# Altium project 海关全向本体电路板V3.PrjPcb
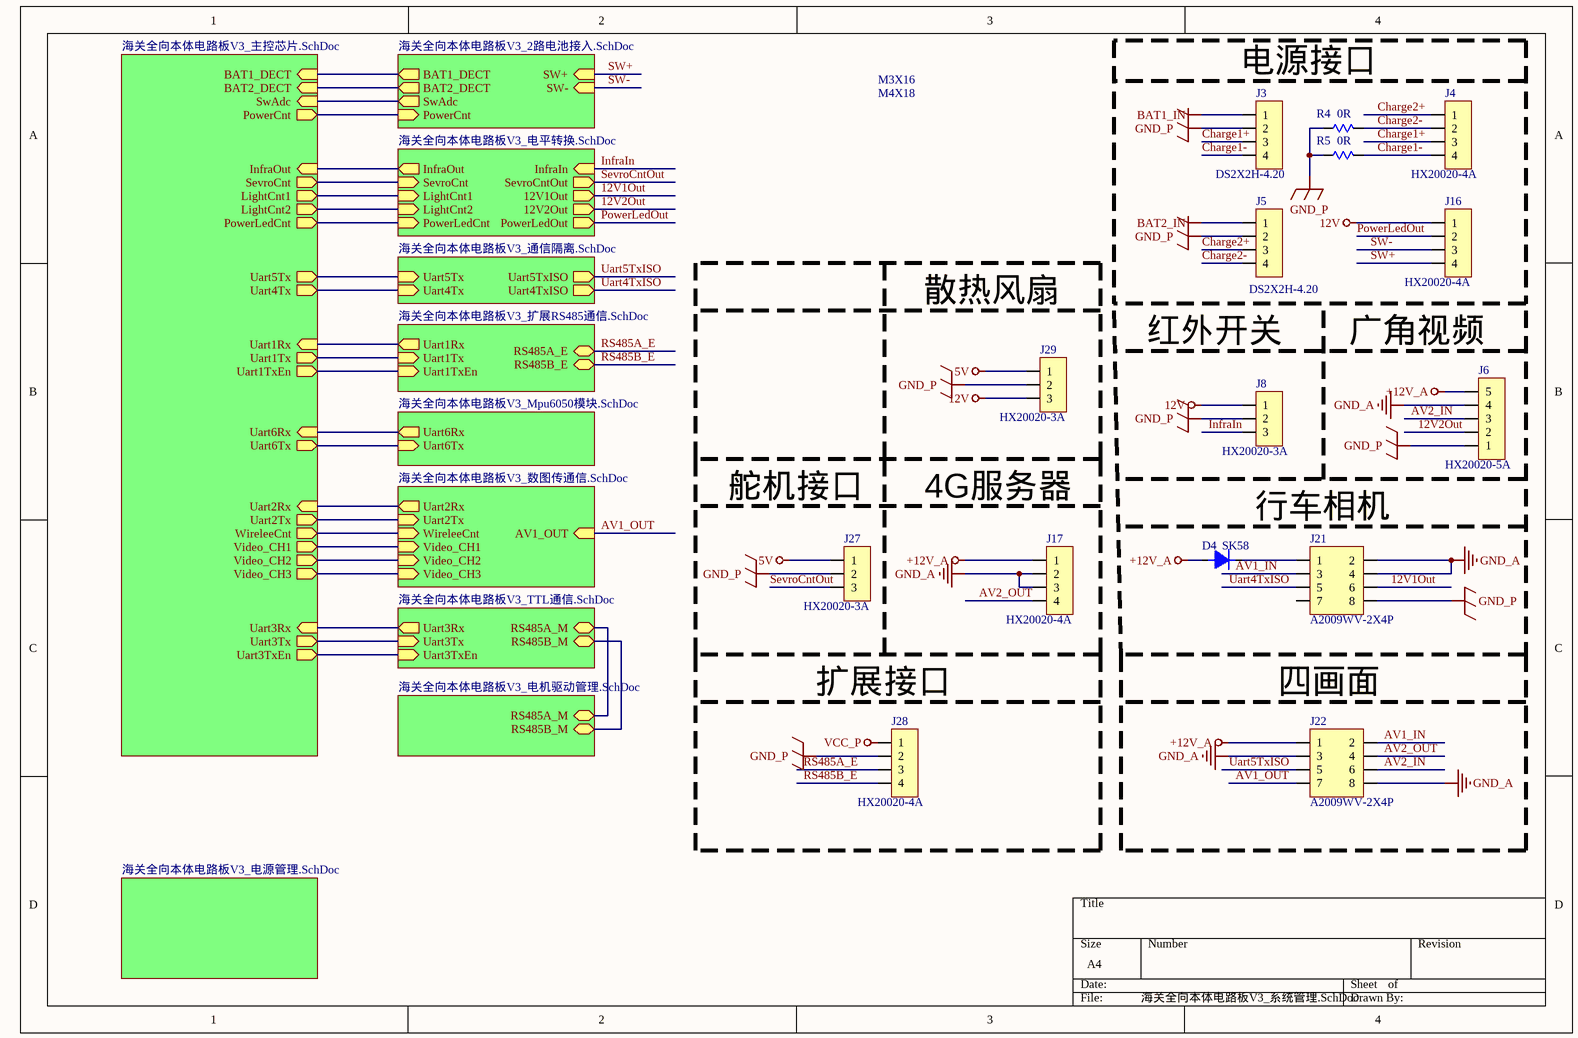
[diagram p0: 海关全向本体电路板V3_系统管理.SchDoc]
17 sheets, 222 parts. Net scope: hierarchical (ports join the sheet entries above them; power ports are global).
Board files: 4G视频服务器尺寸.PcbDoc, 海关全向本体电路板V3.PcbDoc
Sheets:
  海关全向本体电路板V3_系统管理.SchDoc
     = 海关全向本体电路板V3_电机驱动管理.SchDoc
     = 海关全向本体电路板V3_电源管理.SchDoc
     = 海关全向本体电路板V3_主控芯片.SchDoc
      STM32F407VG-A = STM32F407VG-A.SchDoc
      STM32F407VG-B = STM32F407VG-B.SchDoc
      STM32F407VG-C = STM32F407VG-C.SchDoc
      STM32F407VG-D = STM32F407VG-D.SchDoc
      STM32F407VG-E = STM32F407VG-E.SchDoc
      STM32F407VG-F = STM32F407VG-F.SchDoc
     = 海关全向本体电路板V3_电平转换.SchDoc
     = 海关全向本体电路板V3_TTL通信.SchDoc
     = 海关全向本体电路板V3_数图传通信.SchDoc
     = 海关全向本体电路板V3_扩展RS485通信.SchDoc
     = 海关全向本体电路板V3_2路电池接入.SchDoc
     = 海关全向本体电路板V3_通信隔离.SchDoc
     = 海关全向本体电路板V3_Mpu6050模块.SchDoc

## Sheet 海关全向本体电路板V3_系统管理.SchDoc
size A4

### Parts
D4  SK58  [SMB]
J3  DS2X2H-4.20  [5566-04A]
J4  HX20020-4A  [HX20020-4A]
J5  DS2X2H-4.20  [5566-04A]
J6  HX20020-5A  [HX20020-5A]
J8  HX20020-3A  [HX20020-3A]
J16  HX20020-4A  [HX20020-4A]
J17  HX20020-4A  [HX20020-4A]
J21  A2009WV-2X4P  [A2009WV-2X4P]
J22  A2009WV-2X4P  [A2009WV-2X4P]
J27  HX20020-3A  [HX20020-3A]
J28  HX20020-4A  [HX20020-4A]
J29  HX20020-3A  [HX20020-3A]
R4  0R  [R1206-S]
R5  0R  [R1206-S]

### Blocks framed on the sheet
电源接口: J3-J5 J16 R4 R5

### Sub-sheets
? = 海关全向本体电路板V3_电机驱动管理.SchDoc: RS485A_M, RS485B_M
? = 海关全向本体电路板V3_电源管理.SchDoc: no entries
? = 海关全向本体电路板V3_主控芯片.SchDoc: SevroCnt (out), LightCnt1 (out), PowerCnt (out), SwAdc (in), LightCnt2 (out), Uart2Rx (in), Uart2Tx (out), Uart1Tx (out), BAT1_DECT (in), BAT2_DECT (in), PowerLedCnt (out), Uart1Rx (in), Uart4Tx (out), Uart5Tx (out), Uart1TxEn (out), Uart6Tx (out), Uart6Rx (in), Video_CH1 (out), Video_CH2 (out), Video_CH3 (out), WireleeCnt (out), InfraOut (in), Uart3Rx (in), Uart3Tx (out), Uart3TxEn (out)
? = 海关全向本体电路板V3_电平转换.SchDoc: SevroCnt (in), LightCnt1 (in), SevroCntOut (out), 12V1Out (out), LightCnt2 (in), 12V2Out (out), PowerLedCnt (in), PowerLedOut (out), InfraIn (in), InfraOut (out)
? = 海关全向本体电路板V3_TTL通信.SchDoc: RS485A_M, RS485B_M, Uart3Rx (out), Uart3Tx (in), Uart3TxEn (in)
? = 海关全向本体电路板V3_数图传通信.SchDoc: Uart2Rx (out), Uart2Tx (in), Video_CH1 (in), Video_CH2 (in), Video_CH3 (in), WireleeCnt (in), AV1_OUT (in)
? = 海关全向本体电路板V3_扩展RS485通信.SchDoc: Uart1Rx (out), Uart1Tx (in), Uart1TxEn (in), RS485A_E (bidir), RS485B_E (bidir)
? = 海关全向本体电路板V3_2路电池接入.SchDoc: PowerCnt (in), SwAdc (out), SW+ (in), SW- (in), BAT1_DECT (out), BAT2_DECT (out)
? = 海关全向本体电路板V3_通信隔离.SchDoc: Uart5Tx (in), Uart4Tx (in), Uart5TxISO (out), Uart4TxISO (out)
? = 海关全向本体电路板V3_Mpu6050模块.SchDoc: Uart6Rx (out), Uart6Tx (in)

### Nets
5V: J27.1 J29.1
12V: J8.1 J16.1 J29.3
+12V_A: D4.1(A) J6.5 J17.1 J22.1
BAT1_IN: J3.1
BAT2_IN: J5.1
GND_A: J6.4 J17.2 J17.3 J21.2 J21.4 J22.3 J22.8
GND_P: J3.2 J5.2 J6.1 J8.2 J21.8 J27.2 J28.2 J29.2 R4.1 R5.1
VCC_P: J28.1
12V1Out: J21.6 ; sheet /12V1Out
12V2Out: J6.2 ; sheet /12V2Out
AV1_IN: J21.3 J22.2
AV1_OUT: J22.7 ; sheet /AV1_OUT
AV2_IN: J6.3 J22.6
AV2_OUT: J17.4 J22.4
Charge1+: J3.3 J4.3
Charge1-: J3.4 J4.4 R5.2
Charge2+: J4.1 J5.3
Charge2-: J4.2 J5.4 R4.2
InfraIn: J8.3 ; sheet /InfraIn
PowerLedOut: J16.2 ; sheet /PowerLedOut
RS485A_E: J28.3 ; sheet /RS485A_E
RS485A_M: sheet /RS485A_M, sheet /RS485A_M
RS485B_E: J28.4 ; sheet /RS485B_E
RS485B_M: sheet /RS485B_M, sheet /RS485B_M
SevroCntOut: J27.3 ; sheet /SevroCntOut
SW+: J16.4 ; sheet /SW+
SW-: J16.3 ; sheet /SW-
Uart4TxISO: J21.5 ; sheet /Uart4TxISO
Uart5TxISO: J22.5 ; sheet /Uart5TxISO
NetC21_2: sheet /SevroCnt, sheet /SevroCnt
NetC28_1: sheet /BAT1_DECT, sheet /BAT1_DECT
NetC30_1: sheet /BAT2_DECT, sheet /BAT2_DECT
NetC57_2: sheet /SwAdc, sheet /SwAdc
NetD4_2: D4.2(K) J21.1
NetJ2_4: sheet /Uart2Rx, sheet /Uart2Rx
NetJ2_6: sheet /Uart2Tx, sheet /Uart2Tx
NetR6_2: sheet /InfraOut, sheet /InfraOut
NetR20_1: sheet /PowerCnt, sheet /PowerCnt
NetR39_1: sheet /Uart3TxEn, sheet /Uart3TxEn
NetR44_1: sheet /Uart1TxEn, sheet /Uart1TxEn
NetR53_2: sheet /WireleeCnt, sheet /WireleeCnt
NetR70_2: sheet /PowerLedCnt, sheet /PowerLedCnt
NetR71_2: sheet /LightCnt1, sheet /LightCnt1
NetR72_2: sheet /LightCnt2, sheet /LightCnt2
NetU2_3: sheet /Uart5Tx, sheet /Uart5Tx
NetU2_4: sheet /Uart4Tx, sheet /Uart4Tx
NetU3_15: sheet /Video_CH1, sheet /Video_CH1
NetU3_16: sheet /Video_CH2, sheet /Video_CH2
NetU3_17: sheet /Video_CH3, sheet /Video_CH3
NetU3_55: sheet /Uart3Tx, sheet /Uart3Tx
NetU3_56: sheet /Uart3Rx, sheet /Uart3Rx
NetU3_63: sheet /Uart6Tx, sheet /Uart6Tx
NetU3_64: sheet /Uart6Rx, sheet /Uart6Rx
NetU3_68: sheet /Uart1Tx, sheet /Uart1Tx
NetU3_69: sheet /Uart1Rx, sheet /Uart1Rx

Not connected (* = marked no-connect by the designer): J21 7

### Notes on the sheet
- M3X16
- M4X18
- 散热风扇
- 红外开关
- 广角视频
- 舵机接口
- 4G服务器
- (near J21) 行车相机
- (near J28) 扩展接口
- 四画面

### Library data of the parts
D4 = DIODE1: Diode
J3-J5 J16 J17 J28 = HEADER1X4
J6 = HEADER1X5
J8 J27 J29 = HEADER1X3
J21 J22 = HEADER2X4
R4 R5 = RES: Resistor; Published: 8-Jun-2000; LatestRevisionDate: 17-Jul-2002; LatestRevisionNote: Re-released for DXP Platform.; PackageReference: AXIAL-0.3; Publisher: Altium Limited; Value: 0R

## Sheet 海关全向本体电路板V3_电机驱动管理.SchDoc
size A3
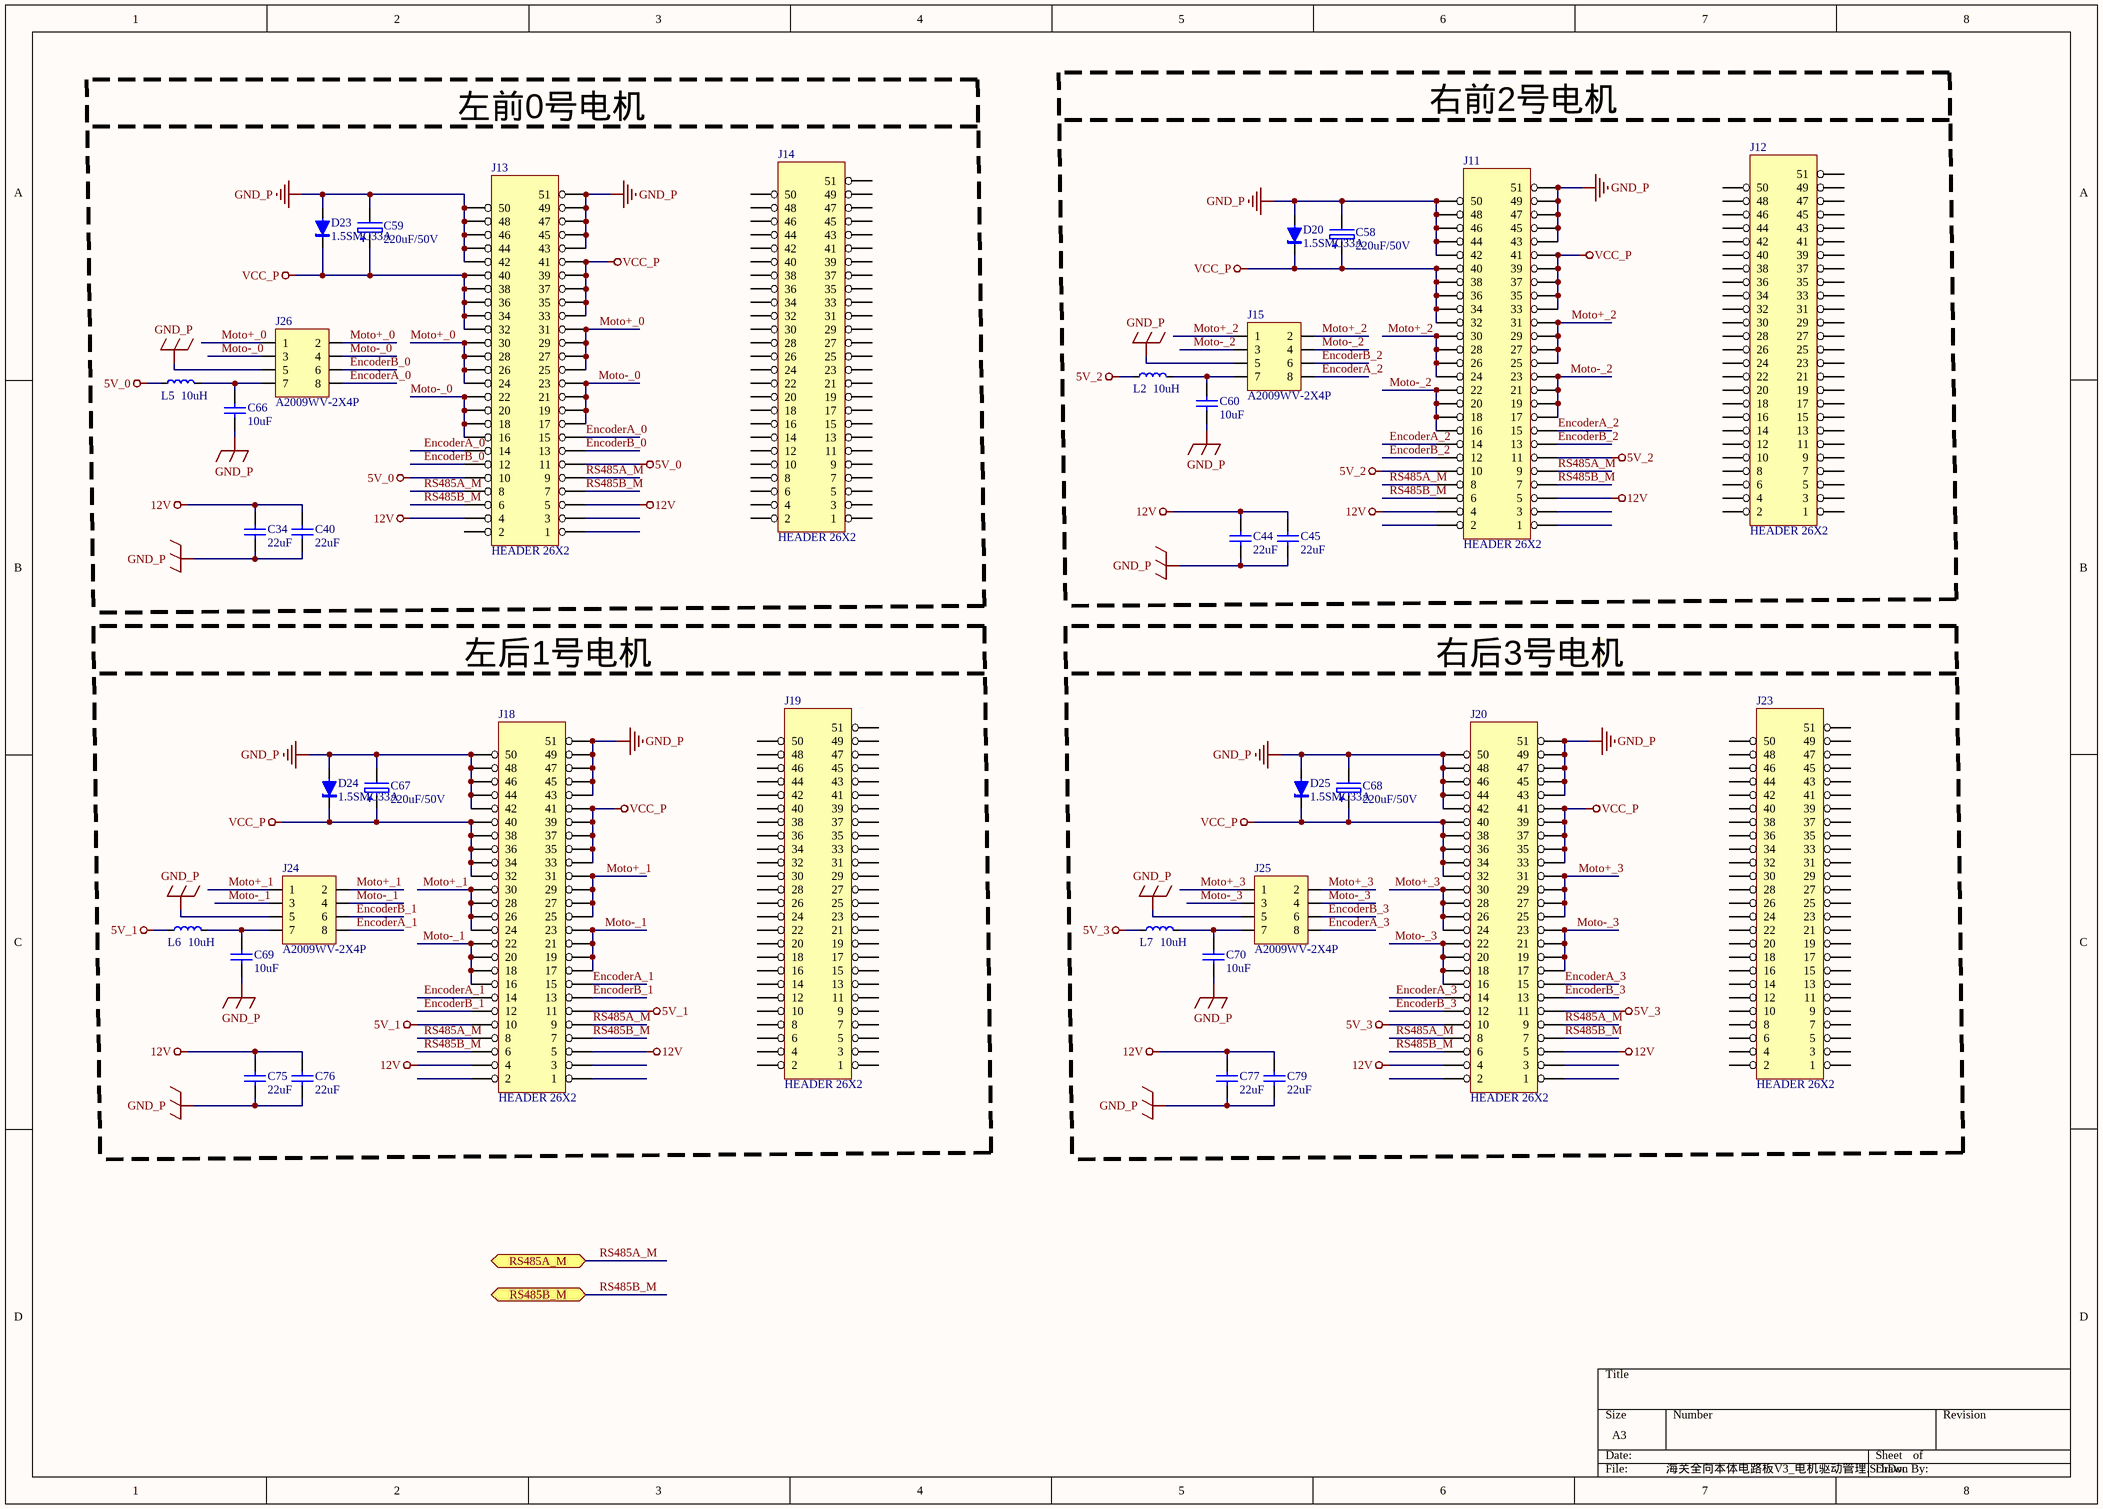
[diagram p1: 海关全向本体电路板V3_电机驱动管理.SchDoc]

### Parts
C34  22uF  [C1206-S]
C40  22uF  [C1206-S]
C44  22uF  [C1206-S]
C45  22uF  [C1206-S]
C58  220uF/50V  [CAPPR-10X10-SM]
C59  220uF/50V  [CAPPR-10X10-SM]
C60  10uF  [C0603-S]
C66  10uF  [C0603-S]
C67  220uF/50V  [CAPPR-10X10-SM]
C68  220uF/50V  [CAPPR-10X10-SM]
C69  10uF  [C0603-S]
C70  10uF  [C0603-S]
C75  22uF  [C1206-S]
C76  22uF  [C1206-S]
C77  22uF  [C1206-S]
C79  22uF  [C1206-S]
D20  1.5SMC33A  [SMC-S]
D23  1.5SMC33A  [SMC-S]
D24  1.5SMC33A  [SMC-S]
D25  1.5SMC33A  [SMC-S]
J11  HEADER 26X2  [DF9-51P-1V]
J12  HEADER 26X2  [DF9-51P-1V]
J13  HEADER 26X2  [DF9-51P-1V]
J14  HEADER 26X2  [DF9-51P-1V]
J15  A2009WV-2X4P  [A2009WV-2X4P]
J18  HEADER 26X2  [DF9-51P-1V]
J19  HEADER 26X2  [DF9-51P-1V]
J20  HEADER 26X2  [DF9-51P-1V]
J23  HEADER 26X2  [DF9-51P-1V]
J24  A2009WV-2X4P  [A2009WV-2X4P]
J25  A2009WV-2X4P  [A2009WV-2X4P]
J26  A2009WV-2X4P  [A2009WV-2X4P]
L2  10uH  [L0805-C]
L5  10uH  [L0805-C]
L6  10uH  [L0805-C]
L7  10uH  [L0805-C]

### Blocks framed on the sheet
左前0号电机: C34 C40 C59 C66 D23 J13 J14 J26 L5
右前2号电机: C44 C45 C58 C60 D20 J11 J12 J15 L2
左后1号电机: C67 C69 C75 C76 D24 J18 J19 J24 L6
右后3号电机: C68 C70 C77 C79 D25 J20 J23 J25 L7

### Ports
RS485A_M (bidir), RS485B_M (bidir)

### Nets
5V_0: J13.10 J13.11 L5.1
5V_1: J18.10 J18.11 L6.1
5V_2: J11.10 J11.11 L2.1
5V_3: J20.10 J20.11 L7.1
12V: C34.1 C40.1 C44.1 C45.1 C75.1 C76.1 C77.1 C79.1 J11.4 J11.5 J13.4 J13.5 J18.4 J18.5 J20.4 J20.5
GND_P: C34.2 C40.2 C44.2 C45.2 C58.2 C59.2 C60.2 C66.2 C67.2 C68.2 C69.2 C70.2 C75.2 C76.2 C77.2 C79.2 D20.1(A) D23.1(A) D24.1(A) D25.1(A) J11.42 J11.43 J11.44 J11.45 J11.46 J11.47 J11.48 J11.49 J11.50 J11.51 J13.42 J13.43 J13.44 J13.45 J13.46 J13.47 J13.48 J13.49 J13.50 J13.51 J15.5 J18.42 J18.43 J18.44 J18.45 J18.46 J18.47 J18.48 J18.49 J18.50 J18.51 J20.42 J20.43 J20.44 J20.45 J20.46 J20.47 J20.48 J20.49 J20.50 J20.51 J24.5 J25.5 J26.5
VCC_P: C58.1 C59.1 C67.1 C68.1 D20.2(K) D23.2(K) D24.2(K) D25.2(K) J11.32 J11.33 J11.34 J11.35 J11.36 J11.37 J11.38 J11.39 J11.40 J11.41 J13.32 J13.33 J13.34 J13.35 J13.36 J13.37 J13.38 J13.39 J13.40 J13.41 J18.32 J18.33 J18.34 J18.35 J18.36 J18.37 J18.38 J18.39 J18.40 J18.41 J20.32 J20.33 J20.34 J20.35 J20.36 J20.37 J20.38 J20.39 J20.40 J20.41
EncoderA_0: J13.14 J13.15 J26.8
EncoderA_1: J18.14 J18.15 J24.8
EncoderA_2: J11.14 J11.15 J15.8
EncoderA_3: J20.14 J20.15 J25.8
EncoderB_0: J13.12 J13.13 J26.6
EncoderB_1: J18.12 J18.13 J24.6
EncoderB_2: J11.12 J11.13 J15.6
EncoderB_3: J20.12 J20.13 J25.6
Moto+_0: J13.24 J13.25 J13.26 J13.27 J13.28 J13.29 J13.30 J13.31 J26.1 J26.2
Moto+_1: J18.24 J18.25 J18.26 J18.27 J18.28 J18.29 J18.30 J18.31 J24.1 J24.2
Moto+_2: J11.24 J11.25 J11.26 J11.27 J11.28 J11.29 J11.30 J11.31 J15.1 J15.2
Moto+_3: J20.24 J20.25 J20.26 J20.27 J20.28 J20.29 J20.30 J20.31 J25.1 J25.2
Moto-_0: J13.16 J13.17 J13.18 J13.19 J13.20 J13.21 J13.22 J13.23 J26.3 J26.4
Moto-_1: J18.16 J18.17 J18.18 J18.19 J18.20 J18.21 J18.22 J18.23 J24.3 J24.4
Moto-_2: J11.16 J11.17 J11.18 J11.19 J11.20 J11.21 J11.22 J11.23 J15.3 J15.4
Moto-_3: J20.16 J20.17 J20.18 J20.19 J20.20 J20.21 J20.22 J20.23 J25.3 J25.4
RS485A_M: J11.8 J11.9 J13.8 J13.9 J18.8 J18.9 J20.8 J20.9 ; port RS485A_M
RS485B_M: J11.6 J11.7 J13.6 J13.7 J18.6 J18.7 J20.6 J20.7 ; port RS485B_M
NetC60_1: C60.1 J15.7 L2.2
NetC66_1: C66.1 J26.7 L5.2
NetC69_1: C69.1 J24.7 L6.2
NetC70_1: C70.1 J25.7 L7.2

Not connected (* = marked no-connect by the designer): J11 1 2 3; J12 1 2 3 4 5 6 7 8 9 10 11 12 13 14 15 16 17 18 19 20 21 22 23 24 25 26 27 28 29 30 31 32 33 34 35 36 37 38 39 40 41 42 43 44 45 46 47 48 49 50 51; J13 1 2 3; J14 1 2 3 4 5 6 7 8 9 10 11 12 13 14 15 16 17 18 19 20 21 22 23 24 25 26 27 28 29 30 31 32 33 34 35 36 37 38 39 40 41 42 43 44 45 46 47 48 49 50 51; J18 1 2 3; J19 1 2 3 4 5 6 7 8 9 10 11 12 13 14 15 16 17 18 19 20 21 22 23 24 25 26 27 28 29 30 31 32 33 34 35 36 37 38 39 40 41 42 43 44 45 46 47 48 49 50 51; J20 1 2 3; J23 1 2 3 4 5 6 7 8 9 10 11 12 13 14 15 16 17 18 19 20 21 22 23 24 25 26 27 28 29 30 31 32 33 34 35 36 37 38 39 40 41 42 43 44 45 46 47 48 49 50 51

### Library data of the parts
C34 C40 C44 C45 C60 C66 C69 C70 C75-C77 C79 = CAP: Published: 8-Jun-2000; LatestRevisionDate: 17-Jul-2002; LatestRevisionNote: Re-released for DXP Platform.; PackageReference: RAD-0.3; Publisher: Altium Limited
  C34 C40 C44 C45 C75-C77 C79: Value: 22uF
  C60 C66 C69 C70: Value: 10uF
C58 C59 C67 C68 = ELECTRO: Electrolytic Capacitor
D20 D23-D25 = DIODE-ZENER: Small Signal Zener Diodes
J11-J14 J18-J20 J23 = HEADER 35X2_1
J15 J24-J26 = HEADER2X4
L2 L5-L7 = INDUCTOR: Code_IEC: 1005; Published: 8-Jun-2000; LatestRevisionDate: 17-Jul-2002; LatestRevisionNote: Re-released for DXP Platform.; PackageReference: 0402-A; Publisher: Altium Limited; Code_JEITA: 0402; Value: 10uH

## Sheet 海关全向本体电路板V3_电源管理.SchDoc
size A4
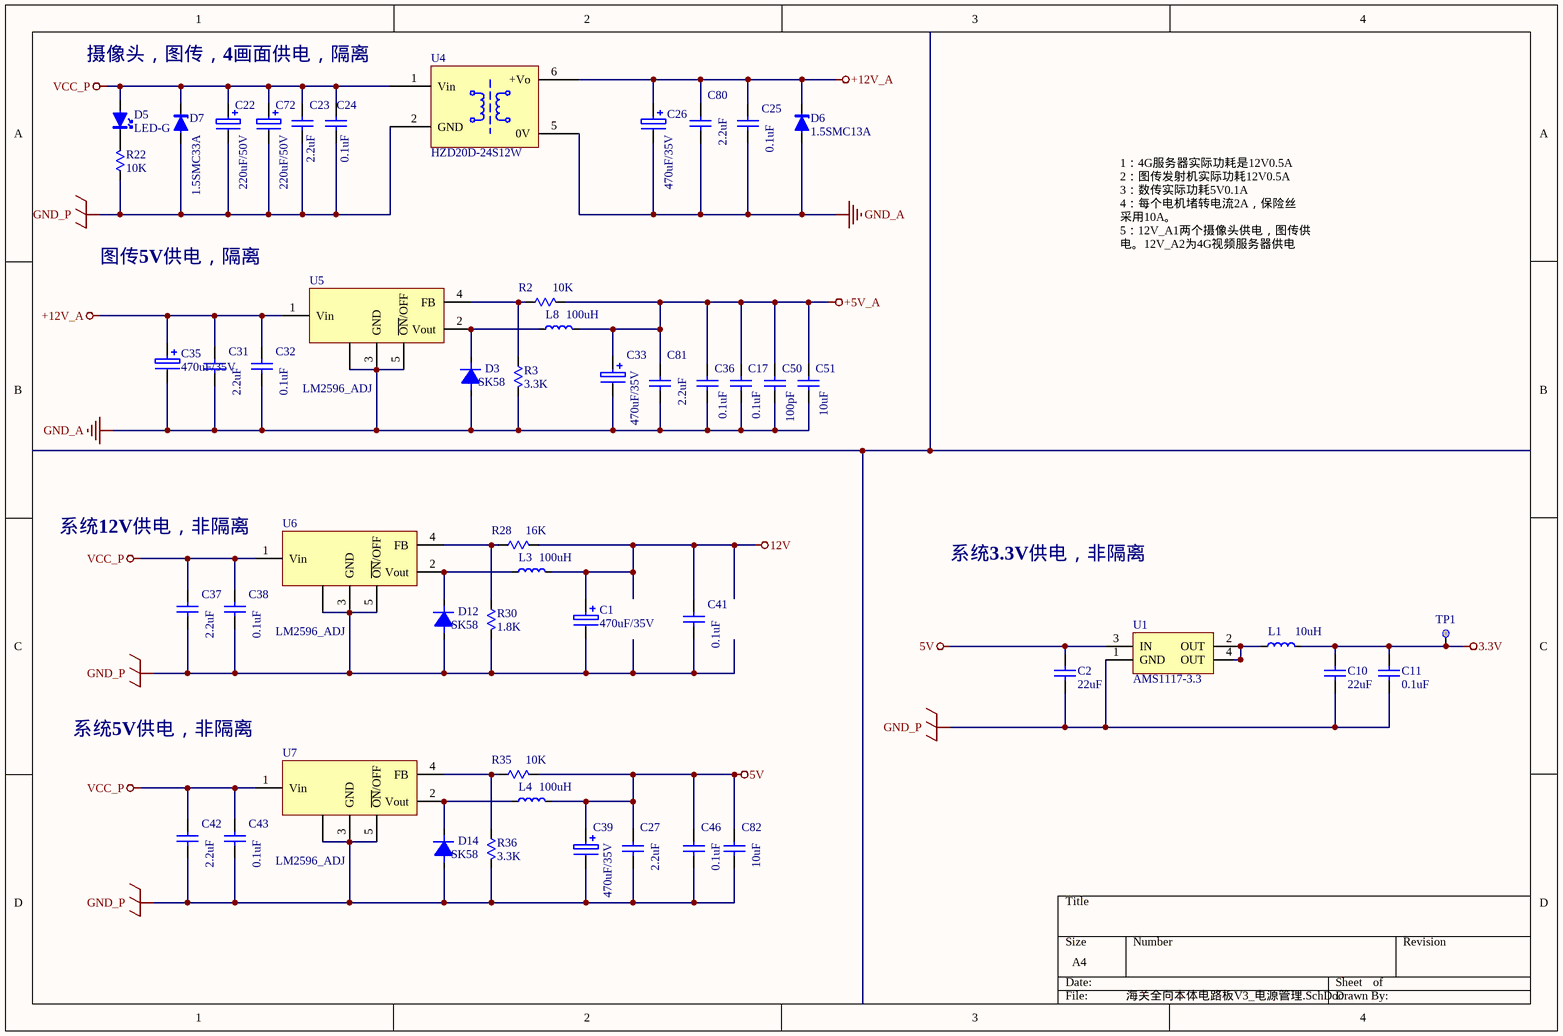
[diagram p2: 海关全向本体电路板V3_电源管理.SchDoc]

### Parts
C1  470uF/35V  [CAPPR-10X10-SM]
C2  22uF  [C1206-S]
C10  22uF  [C1206-S]
C11  0.1uF  [C0603-S]
C17  0.1uF  [C0603-S]
C22  220uF/50V  [CAPPR-10X10-SM]
C23  2.2uF  [C1210-S]
C24  0.1uF  [C0603-S]
C25  0.1uF  [C0603-S]
C26  470uF/35V  [CAPPR-10X10-SM]
C27  2.2uF  [C1210-S]
C31  2.2uF  [C1210-S]
C32  0.1uF  [C0603-S]
C33  470uF/35V  [CAPPR-10X10-SM]
C35  470uF/35V  [CAPPR-10X10-SM]
C36  0.1uF  [C0603-S]
C37  2.2uF  [C1210-S]
C38  0.1uF  [C0603-S]
C39  470uF/35V  [CAPPR-10X10-SM]
C41  0.1uF  [C0603-S]
C42  2.2uF  [C1210-S]
C43  0.1uF  [C0603-S]
C46  0.1uF  [C0603-S]
C50  100pF  [C0603-S]
C51  10uF  [C0603-S]
C72  220uF/50V  [CAPPR-10X10-SM]
C80  2.2uF  [C1210-S]
C81  2.2uF  [C1210-S]
C82  10uF  [C0603-S]
D3  SK58  [SMB-S]
D5  LED-G  [LED0805-S]
D6  1.5SMC13A  [SMC-S]
D7  1.5SMC33A  [SMC-S]
D12  SK58  [SMB-S]
D14  SK58  [SMB-S]
L1  10uH  [L0805-C]
L3  100uH  [L5050-P]
L4  100uH  [L5050-P]
L8  100uH  [L5050-P]
R2  10K  [R0805-S]
R3  3.3K  [R0805-S]
R22  10K  [R0805-S]
R28  16K  [R0805-S]
R30  1.8K  [R0805-S]
R35  10K  [R0805-S]
R36  3.3K  [R0805-S]
TP1  TestPoint  [MARK-S]  (value not drawn)
U1  AMS1117-3.3  [SOT-223]
U4  HZD20D-24S12W  [HZD20D-24S12W]
U5  LM2596_ADJ  [TO263]
U6  LM2596_ADJ  [TO263]
U7  LM2596_ADJ  [TO263]

### Nets
3.3V: C10.1 C11.2 L1.1 TP1.1
5V: C2.1 C27.2 C39.1 C46.2 C82.2 L4.1 R35.1 U1.3(IN)
12V: C1.1 C41.2 L3.1 R28.1
+5V_A: C17.2 C33.1 C36.2 C50.2 C51.2 C81.2 L8.1 R2.1
+12V_A: C25.2 C26.1 C31.2 C32.2 C35.1 C80.2 D6.2(K) U4.6(+Vo) U5.1(Vin)
GND_A: C17.1 C25.1 C26.2 C31.1 C32.1 C33.2 C35.2 C36.1 C50.1 C51.1 C80.1 C81.1 D3.1(A) D6.1(A) R3.1 U4.5(0V) U5.0(GND) U5.3(GND) U5.5(~{ON}/OFF)
GND_P: C1.2 C2.2 C10.2 C11.1 C22.2 C23.1 C24.1 C27.1 C37.1 C38.1 C39.2 C41.1 C42.1 C43.1 C46.1 C72.2 C82.1 D7.1(A) D12.1(A) D14.1(A) R22.2 R30.1 R36.1 U1.1(GND) U4.2(GND) U6.0(GND) U6.3(GND) U6.5(~{ON}/OFF) U7.0(GND) U7.3(GND) U7.5(~{ON}/OFF)
VCC_P: C22.1 C23.2 C24.2 C37.2 C38.2 C42.2 C43.2 C72.1 D5.1(A) D7.2(K) U4.1(Vin) U6.1(Vin) U7.1(Vin)
NetD3_2: D3.2(K) L8.2 U5.2(Vout)
NetD5_2: D5.2(K) R22.1
NetD12_2: D12.2(K) L3.2 U6.2(Vout)
NetD14_2: D14.2(K) L4.2 U7.2(Vout)
NetL1_2: L1.2 U1.2(OUT) U1.4(OUT)
NetR2_2: R2.2 R3.2 U5.4(FB)
NetR28_2: R28.2 R30.2 U6.4(FB)
NetR35_2: R35.2 R36.2 U7.4(FB)

### Notes on the sheet
- 摄像头，图传，4画面供电，隔离
- 图传5V供电，隔离
- 1：4G服务器实际功耗是12V0.5A
  2：图传发射机实际功耗12V0.5A
  3：数传实际功耗5V0.1A
  4：每个电机堵转电流2A，保险丝        采用10A。
  5：12V_A1两个摄像头供电，图传供电。12V_A2为4G视频服务器供电
- 系统12V供电，非隔离
- 系统3.3V供电，非隔离
- 系统5V供电，非隔离

### Library data of the parts
C1 C22 C26 C33 C35 C39 C72 = ELECTRO: Electrolytic Capacitor
C2 C10 C11 C17 C23-C25 C27 C31 C32 C36-C38 C41-C43 C46 C50 C51 C80-C82 = CAP: Published: 8-Jun-2000; LatestRevisionDate: 17-Jul-2002; LatestRevisionNote: Re-released for DXP Platform.; PackageReference: RAD-0.3; Publisher: Altium Limited
  C2 C10: Value: 22uF
  C11 C17 C24 C25 C32 C36 C38 C41 C43 C46: Value: 0.1uF
  C23 C27 C31 C37 C42 C80 C81: Value: 2.2uF
  C50: Value: 100pF
  C51 C82: Value: 10uF
D3 D12 D14 = DIODE1: Diode
D5 = LED
D6 D7 = DIODE-ZENER: Small Signal Zener Diodes
L1 L3 L4 L8 = INDUCTOR: Code_IEC: 1005; Published: 8-Jun-2000; LatestRevisionDate: 17-Jul-2002; LatestRevisionNote: Re-released for DXP Platform.; PackageReference: 0402-A; Publisher: Altium Limited; Code_JEITA: 0402
  L1: Value: 10uH
  L3 L4 L8: Value: 100uH
R2 R3 R28 R30 R35 R36 = RES: Resistor; Published: 8-Jun-2000; LatestRevisionDate: 17-Jul-2002; LatestRevisionNote: Re-released for DXP Platform.; PackageReference: AXIAL-0.3; Publisher: Altium Limited
  R2 R35: Value: 10K
  R3 R36: Value: 3.3K
  R28: Value: 16K
  R30: Value: 1.8K
R22 = Res: Resistor; Published: 8-Jun-2000; LatestRevisionDate: 04-Mar-2005; LatestRevisionNote: PCB Footprint replaced.; PackageReference: J1-0603; Publisher: Altium Limited; Value: 10K
U1 = REG1117-3.3: 800mA and 1A Low Dropout Positive Regulator 2.85V, 3.3V, 5V, and Adjustable; Package Information: Latest Revision: revC; Published: 8-Jun-2000; Revision: 17-Jul-2002: Re-released for DXP Platform.; Datasheet: Latest Revision: Sep-1997; Package Reference: ZZ311; Publisher: Altium Limited
U5-U7 = LM2575

## Sheet 海关全向本体电路板V3_主控芯片.SchDoc
size A4
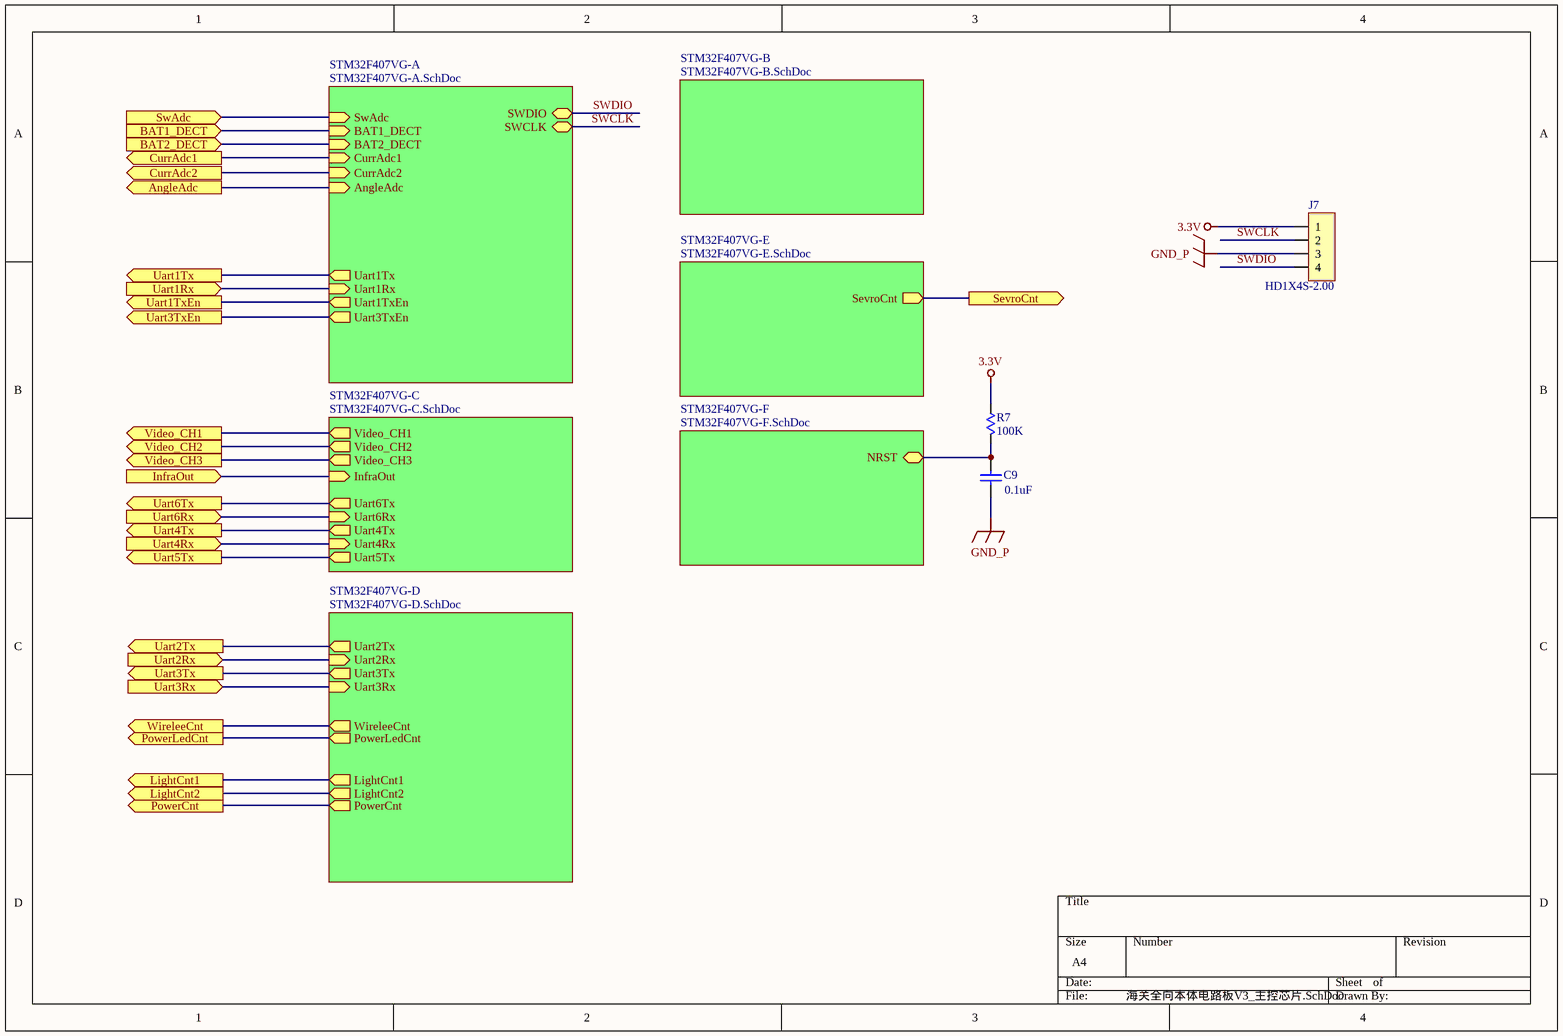
[diagram p3: 海关全向本体电路板V3_主控芯片.SchDoc]

### Parts
C9  0.1uF  [C0603-S]
J7  HD1X4S-2.00  [HD1X4S-2.00]
R7  100K  [R0603-S]

### Sub-sheets
STM32F407VG-A = STM32F407VG-A.SchDoc: SWDIO (bidir), SWCLK (bidir), Uart1Tx (out), Uart1Rx (in), AngleAdc (in), CurrAdc1 (in), BAT2_DECT (in), BAT1_DECT (in), SwAdc (in), CurrAdc2 (in), Uart1TxEn (out), Uart3TxEn (out)
STM32F407VG-B = STM32F407VG-B.SchDoc: no entries
STM32F407VG-C = STM32F407VG-C.SchDoc: Uart4Tx (out), Uart4Rx (in), Uart5Tx (out), Video_CH3 (out), Video_CH2 (out), Video_CH1 (out), Uart6Tx (out), Uart6Rx (in), InfraOut (in)
STM32F407VG-D = STM32F407VG-D.SchDoc: Uart2Tx (out), Uart2Rx (in), Uart3Tx (out), PowerLedCnt (out), LightCnt1 (out), Uart3Rx (in), PowerCnt (out), LightCnt2 (out), WireleeCnt (out)
STM32F407VG-E = STM32F407VG-E.SchDoc: SevroCnt (out)
STM32F407VG-F = STM32F407VG-F.SchDoc: NRST (bidir)

### Ports
AngleAdc (out), BAT1_DECT (in), BAT2_DECT (in), CurrAdc1 (out), CurrAdc2 (out), InfraOut (in), LightCnt1 (out), LightCnt2 (out), PowerCnt (out), PowerLedCnt (out), SevroCnt (out), SwAdc (in), Uart1Rx (in), Uart1Tx (out), Uart1TxEn (out), Uart2Rx (in), Uart2Tx (out), Uart3Rx (in), Uart3Tx (out), Uart3TxEn (out), Uart4Rx (in), Uart4Tx (out), Uart5Tx (out), Uart6Rx (in), Uart6Tx (out), Video_CH1 (out), Video_CH2 (out), Video_CH3 (out), WireleeCnt (out)

### Nets
3.3V: J7.1 R7.2
GND_P: C9.2 J7.3
NRST: C9.1 R7.1 ; sheet STM32F407VG-F/NRST
SWCLK: J7.2 ; sheet STM32F407VG-A/SWCLK
SWDIO: J7.4 ; sheet STM32F407VG-A/SWDIO
Uart4Rx: port Uart4Rx, sheet STM32F407VG-C/Uart4Rx
NetC21_2: port SevroCnt, sheet STM32F407VG-E/SevroCnt
NetC28_1: port BAT1_DECT, sheet STM32F407VG-A/BAT1_DECT
NetC30_1: port BAT2_DECT, sheet STM32F407VG-A/BAT2_DECT
NetC57_2: port SwAdc, sheet STM32F407VG-A/SwAdc
NetJ2_4: port Uart2Rx, sheet STM32F407VG-D/Uart2Rx
NetJ2_6: port Uart2Tx, sheet STM32F407VG-D/Uart2Tx
NetR6_2: port InfraOut, sheet STM32F407VG-C/InfraOut
NetR20_1: port PowerCnt, sheet STM32F407VG-D/PowerCnt
NetR39_1: port Uart3TxEn, sheet STM32F407VG-A/Uart3TxEn
NetR44_1: port Uart1TxEn, sheet STM32F407VG-A/Uart1TxEn
NetR53_2: port WireleeCnt, sheet STM32F407VG-D/WireleeCnt
NetR70_2: port PowerLedCnt, sheet STM32F407VG-D/PowerLedCnt
NetR71_2: port LightCnt1, sheet STM32F407VG-D/LightCnt1
NetR72_2: port LightCnt2, sheet STM32F407VG-D/LightCnt2
NetU2_3: port Uart5Tx, sheet STM32F407VG-C/Uart5Tx
NetU2_4: port Uart4Tx, sheet STM32F407VG-C/Uart4Tx
NetU3_15: port Video_CH1, sheet STM32F407VG-C/Video_CH1
NetU3_16: port Video_CH2, sheet STM32F407VG-C/Video_CH2
NetU3_17: port Video_CH3, sheet STM32F407VG-C/Video_CH3
NetU3_25: port AngleAdc, sheet STM32F407VG-A/AngleAdc
NetU3_30: port CurrAdc1, sheet STM32F407VG-A/CurrAdc1
NetU3_31: port CurrAdc2, sheet STM32F407VG-A/CurrAdc2
NetU3_55: port Uart3Tx, sheet STM32F407VG-D/Uart3Tx
NetU3_56: port Uart3Rx, sheet STM32F407VG-D/Uart3Rx
NetU3_63: port Uart6Tx, sheet STM32F407VG-C/Uart6Tx
NetU3_64: port Uart6Rx, sheet STM32F407VG-C/Uart6Rx
NetU3_68: port Uart1Tx, sheet STM32F407VG-A/Uart1Tx
NetU3_69: port Uart1Rx, sheet STM32F407VG-A/Uart1Rx

### Library data of the parts
C9 = Cap: Capacitor; Published: 8-Jun-2000; Revision: July-2002: Re-released for DXP Platform.; Publisher: Altium Limited; Value: 0.1uF
J7 = HEADER1X4
R7 = Res: Resistor; Published: 8-Jun-2000; LatestRevisionDate: 04-Mar-2005; LatestRevisionNote: PCB Footprint replaced.; PackageReference: J1-0603; Publisher: Altium Limited; Value: 100K

## Sheet STM32F407VG-A.SchDoc
size A4
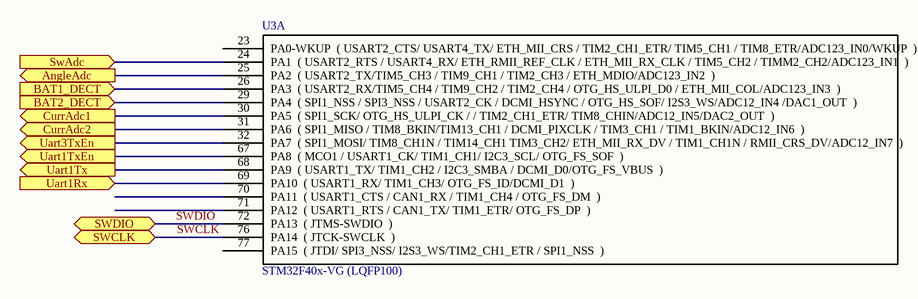
[diagram p4: STM32F407VG-A.SchDoc]

### Parts
U3  STM32F40x-VG (LQFP100)  [LQFP100_N]  (part A of 6)

### Ports
AngleAdc (out), BAT1_DECT (in), BAT2_DECT (in), CurrAdc1 (out), CurrAdc2 (out), SwAdc (in), SWCLK (bidir), SWDIO (bidir), Uart1Rx (in), Uart1Tx (out), Uart1TxEn (out), Uart3TxEn (out)

### Nets
SWCLK: U3.76(PA14__(_JTCK-SWCLK__)) ; port SWCLK
SWDIO: U3.72(PA13__(_JTMS-SWDIO__)) ; port SWDIO
NetC28_1: U3.26(PA3__(_USART2_RX/TIM5_CH4_/_TIM9_CH2_/_TIM2_CH4_/_OTG_HS_ULPI_D0_/_ETH_MII_COL/ADC123_IN3__)) ; port BAT1_DECT
NetC30_1: U3.29(PA4__(_SPI1_NSS_/_SPI3_NSS_/_USART2_CK_/_DCMI_HSYNC_/_OTG_HS_SOF/_I2S3_WS/ADC12_IN4_/DAC1_OUT__)) ; port BAT2_DECT
NetC57_2: U3.24(PA1__(_USART2_RTS_/_USART4_RX/_ETH_RMII_REF_CLK_/_ETH_MII_RX_CLK_/_TIM5_CH2_/_TIMM2_CH2/ADC123_IN1__)) ; port SwAdc
NetR39_1: U3.32(PA7__(_SPI1_MOSI/_TIM8_CH1N_/_TIM14_CH1_TIM3_CH2/_ETH_MII_RX_DV_/_TIM1_CH1N_/_RMII_CRS_DV/ADC12_IN7__)) ; port Uart3TxEn
NetR44_1: U3.67(PA8__(_MCO1_/_USART1_CK/_TIM1_CH1/_I2C3_SCL/_OTG_FS_SOF__)) ; port Uart1TxEn
NetU3_25: U3.25(PA2__(_USART2_TX/TIM5_CH3_/_TIM9_CH1_/_TIM2_CH3_/_ETH_MDIO/ADC123_IN2__)) ; port AngleAdc
NetU3_30: U3.30(PA5__(_SPI1_SCK/_OTG_HS_ULPI_CK_/_/_TIM2_CH1_ETR/_TIM8_CHIN/ADC12_IN5/DAC2_OUT__)) ; port CurrAdc1
NetU3_31: U3.31(PA6__(_SPI1_MISO_/_TIM8_BKIN/TIM13_CH1_/_DCMI_PIXCLK_/_TIM3_CH1_/_TIM1_BKIN/ADC12_IN6__)) ; port CurrAdc2
NetU3_68: U3.68(PA9__(_USART1_TX/_TIM1_CH2_/_I2C3_SMBA_/_DCMI_D0/OTG_FS_VBUS__)) ; port Uart1Tx
NetU3_69: U3.69(PA10__(_USART1_RX/_TIM1_CH3/_OTG_FS_ID/DCMI_D1__)) ; port Uart1Rx

Not connected (* = marked no-connect by the designer): U3 23(PA0-WKUP__(_USART2_CTS/_USART4_TX/_ETH_MII_CRS_/_TIM2_CH1_ETR/_TIM5_CH1_/_TIM8_ETR/ADC123_IN0/WKUP__)) 70(PA11__(_USART1_CTS_/_CAN1_RX_/_TIM1_CH4_/_OTG_FS_DM__)) 71(PA12__(_USART1_RTS_/_CAN1_TX/_TIM1_ETR/_OTG_FS_DP__)) 77(PA15__(_JTDI/_SPI3_NSS/_I2S3_WS/TIM2_CH1_ETR_/_SPI1_NSS__))

### Library data of the parts
U3 = STM32F40x-VG

## Sheet STM32F407VG-B.SchDoc
size A4
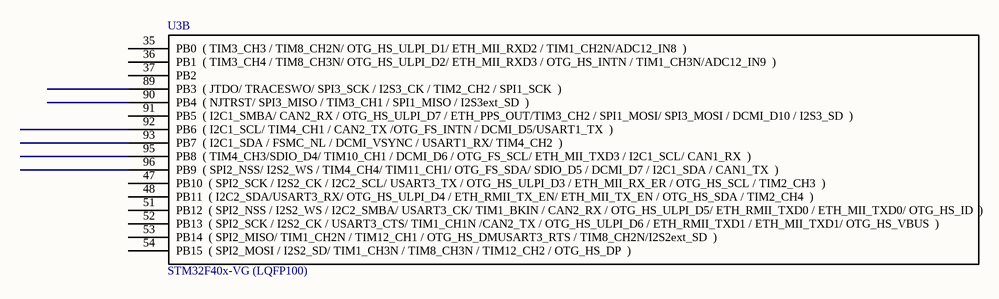
[diagram p5: STM32F407VG-B.SchDoc]

### Parts
U3  STM32F40x-VG (LQFP100)  [LQFP100_N]  (part B of 6)

### Nets

Not connected (* = marked no-connect by the designer): U3 35(PB0__(_TIM3_CH3_/_TIM8_CH2N/_OTG_HS_ULPI_D1/_ETH_MII_RXD2_/_TIM1_CH2N/ADC12_IN8__)) 36(PB1__(_TIM3_CH4_/_TIM8_CH3N/_OTG_HS_ULPI_D2/_ETH_MII_RXD3_/_OTG_HS_INTN_/_TIM1_CH3N/ADC12_IN9__)) 37(PB2) 47(PB10__(_SPI2_SCK_/_I2S2_CK_/_I2C2_SCL/_USART3_TX_/_OTG_HS_ULPI_D3_/_ETH_MII_RX_ER_/_OTG_HS_SCL_/_TIM2_CH3__)) 48(PB11__(_I2C2_SDA/USART3_RX/_OTG_HS_ULPI_D4_/_ETH_RMII_TX_EN/_ETH_MII_TX_EN_/_OTG_HS_SDA_/_TIM2_CH4__)) 51(PB12__(_SPI2_NSS_/_I2S2_WS_/_I2C2_SMBA/_USART3_CK/_TIM1_BKIN_/_CAN2_RX_/_OTG_HS_ULPI_D5/_ETH_RMII_TXD0_/_ETH_MII_TXD0/_OTG_HS_ID__)) 52(PB13__(_SPI2_SCK_/_I2S2_CK_/_USART3_CTS/_TIM1_CH1N_/CAN2_TX_/_OTG_HS_ULPI_D6_/_ETH_RMII_TXD1_/_ETH_MII_TXD1/_OTG_HS_VBUS__)) 53(PB14__(_SPI2_MISO/_TIM1_CH2N_/_TIM12_CH1_/_OTG_HS_DMUSART3_RTS_/_TIM8_CH2N/I2S2ext_SD__)) 54(PB15__(_SPI2_MOSI_/_I2S2_SD/_TIM1_CH3N_/_TIM8_CH3N_/_TIM12_CH2_/_OTG_HS_DP__)) 89(PB3__(_JTDO/_TRACESWO/_SPI3_SCK_/_I2S3_CK_/_TIM2_CH2_/_SPI1_SCK__)) 90(PB4__(_NJTRST/_SPI3_MISO_/_TIM3_CH1_/_SPI1_MISO_/_I2S3ext_SD__)) 91(PB5__(_I2C1_SMBA/_CAN2_RX_/_OTG_HS_ULPI_D7_/_ETH_PPS_OUT/TIM3_CH2_/_SPI1_MOSI/_SPI3_MOSI_/_DCMI_D10_/_I2S3_SD__)) 92(PB6__(_I2C1_SCL/_TIM4_CH1_/_CAN2_TX_/OTG_FS_INTN_/_DCMI_D5/USART1_TX__)) 93(PB7__(_I2C1_SDA_/_FSMC_NL_/_DCMI_VSYNC_/_USART1_RX/_TIM4_CH2__)) 95(PB8__(_TIM4_CH3/SDIO_D4/_TIM10_CH1_/_DCMI_D6_/_OTG_FS_SCL/_ETH_MII_TXD3_/_I2C1_SCL/_CAN1_RX__)) 96(PB9__(_SPI2_NSS/_I2S2_WS_/_TIM4_CH4/_TIM11_CH1/_OTG_FS_SDA/_SDIO_D5_/_DCMI_D7_/_I2C1_SDA_/_CAN1_TX__))

### Library data of the parts
U3 = STM32F40x-VG

## Sheet STM32F407VG-C.SchDoc
size A4
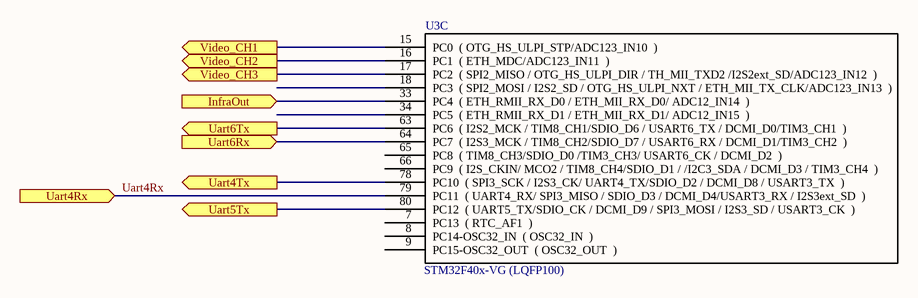
[diagram p6: STM32F407VG-C.SchDoc]

### Parts
U3  STM32F40x-VG (LQFP100)  [LQFP100_N]  (part C of 6)

### Ports
InfraOut (in), Uart4Rx (in), Uart4Tx (out), Uart5Tx (out), Uart6Rx (in), Uart6Tx (out), Video_CH1 (out), Video_CH2 (out), Video_CH3 (out)

### Nets
Uart4Rx: U3.79(PC11__(_UART4_RX/_SPI3_MISO_/_SDIO_D3_/_DCMI_D4/USART3_RX_/_I2S3ext_SD__)) ; port Uart4Rx
NetR6_2: U3.33(PC4__(_ETH_RMII_RX_D0_/_ETH_MII_RX_D0/_ADC12_IN14__)) ; port InfraOut
NetU2_3: U3.80(PC12__(_UART5_TX/SDIO_CK_/_DCMI_D9_/_SPI3_MOSI_/_I2S3_SD_/_USART3_CK__)) ; port Uart5Tx
NetU2_4: U3.78(PC10__(_SPI3_SCK_/_I2S3_CK/_UART4_TX/SDIO_D2_/_DCMI_D8_/_USART3_TX__)) ; port Uart4Tx
NetU3_15: U3.15(PC0__(_OTG_HS_ULPI_STP/ADC123_IN10__)) ; port Video_CH1
NetU3_16: U3.16(PC1__(_ETH_MDC/ADC123_IN11__)) ; port Video_CH2
NetU3_17: U3.17(PC2__(_SPI2_MISO_/_OTG_HS_ULPI_DIR_/_TH_MII_TXD2_/I2S2ext_SD/ADC123_IN12__)) ; port Video_CH3
NetU3_63: U3.63(PC6__(_I2S2_MCK_/_TIM8_CH1/SDIO_D6_/_USART6_TX_/_DCMI_D0/TIM3_CH1__)) ; port Uart6Tx
NetU3_64: U3.64(PC7__(_I2S3_MCK_/_TIM8_CH2/SDIO_D7_/_USART6_RX_/_DCMI_D1/TIM3_CH2__)) ; port Uart6Rx

Not connected (* = marked no-connect by the designer): U3 7(PC13__(_RTC_AF1__)) 8(PC14-OSC32_IN__(_OSC32_IN__)) 9(PC15-OSC32_OUT__(_OSC32_OUT__)) 18(PC3__(_SPI2_MOSI_/_I2S2_SD_/_OTG_HS_ULPI_NXT_/_ETH_MII_TX_CLK/ADC123_IN13__)) 34(PC5__(_ETH_RMII_RX_D1_/_ETH_MII_RX_D1/_ADC12_IN15__)) 65(PC8__(_TIM8_CH3/SDIO_D0_/TIM3_CH3/_USART6_CK_/_DCMI_D2__)) 66(PC9__(_I2S_CKIN/_MCO2_/_TIM8_CH4/SDIO_D1_/_/I2C3_SDA_/_DCMI_D3_/_TIM3_CH4__))

### Library data of the parts
U3 = STM32F40x-VG

## Sheet STM32F407VG-D.SchDoc
size A4
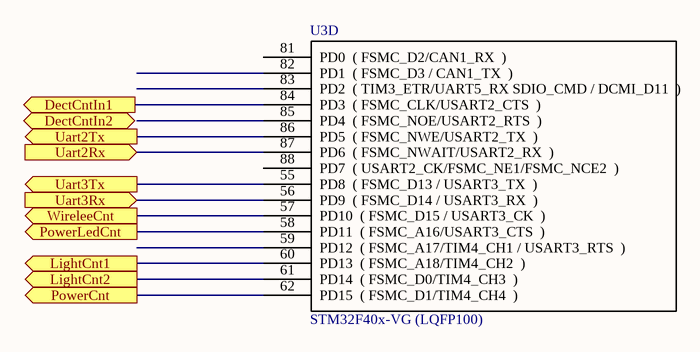
[diagram p7: STM32F407VG-D.SchDoc]

### Parts
U3  STM32F40x-VG (LQFP100)  [LQFP100_N]  (part D of 6)

### Ports
DectCntIn1 (out), DectCntIn2 (out), LightCnt1 (out), LightCnt2 (out), PowerCnt (out), PowerLedCnt (out), Uart2Rx (in), Uart2Tx (out), Uart3Rx (in), Uart3Tx (out), WireleeCnt (out)

### Nets
NetJ2_4: U3.87(PD6__(_FSMC_NWAIT/USART2_RX__)) ; port Uart2Rx
NetJ2_6: U3.86(PD5__(_FSMC_NWE/USART2_TX__)) ; port Uart2Tx
NetR20_1: U3.62(PD15__(_FSMC_D1/TIM4_CH4__)) ; port PowerCnt
NetR53_2: U3.57(PD10__(_FSMC_D15_/_USART3_CK__)) ; port WireleeCnt
NetR70_2: U3.58(PD11__(_FSMC_A16/USART3_CTS__)) ; port PowerLedCnt
NetR71_2: U3.60(PD13__(_FSMC_A18/TIM4_CH2__)) ; port LightCnt1
NetR72_2: U3.61(PD14__(_FSMC_D0/TIM4_CH3__)) ; port LightCnt2
NetU3_55: U3.55(PD8__(_FSMC_D13_/_USART3_TX__)) ; port Uart3Tx
NetU3_56: U3.56(PD9__(_FSMC_D14_/_USART3_RX__)) ; port Uart3Rx
NetU3_84: U3.84(PD3__(_FSMC_CLK/USART2_CTS__)) ; port DectCntIn1

Not connected (* = marked no-connect by the designer): U3 59(PD12__(_FSMC_A17/TIM4_CH1_/_USART3_RTS__)) 81(PD0__(_FSMC_D2/CAN1_RX__)) 82(PD1__(_FSMC_D3_/_CAN1_TX__)) 83(PD2__(_TIM3_ETR/UART5_RX_SDIO_CMD_/_DCMI_D11__)) 85(PD4__(_FSMC_NOE/USART2_RTS__)) 88(PD7__(_USART2_CK/FSMC_NE1/FSMC_NCE2__))

### Library data of the parts
U3 = STM32F40x-VG

## Sheet STM32F407VG-E.SchDoc
size A4
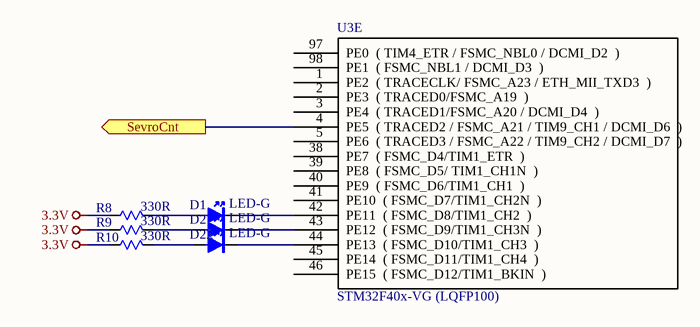
[diagram p8: STM32F407VG-E.SchDoc]

### Parts
D1  LED-G  [LED0603]
D2  LED-G  [LED0603]
D22  LED-G  [LED0603]
R8  330R  [R0603-S]
R9  330R  [R0603-S]
R10  330R  [R0603-S]
U3  STM32F40x-VG (LQFP100)  [LQFP100_N]  (part E of 6)

### Ports
SevroCnt (out)

### Nets
3.3V: R8.2 R9.2 R10.2
NetC21_2: U3.4(PE5__(_TRACED2_/_FSMC_A21_/_TIM9_CH1_/_DCMI_D6__)) ; port SevroCnt
NetD1_1: D1.1(A) R8.1
NetD1_2: D1.2(K) U3.42(PE11__(_FSMC_D8/TIM1_CH2__))
NetD2_1: D2.1(A) R9.1
NetD2_2: D2.2(K) U3.43(PE12__(_FSMC_D9/TIM1_CH3N__))
NetD22_1: D22.1(A) R10.1
NetD22_2: D22.2(K) U3.44(PE13__(_FSMC_D10/TIM1_CH3__))

Not connected (* = marked no-connect by the designer): U3 1(PE2__(_TRACECLK/_FSMC_A23_/_ETH_MII_TXD3__)) 2(PE3__(_TRACED0/FSMC_A19__)) 3(PE4__(_TRACED1/FSMC_A20_/_DCMI_D4__)) 5(PE6__(_TRACED3_/_FSMC_A22_/_TIM9_CH2_/_DCMI_D7__)) 38(PE7__(_FSMC_D4/TIM1_ETR__)) 39(PE8__(_FSMC_D5/_TIM1_CH1N__)) 40(PE9__(_FSMC_D6/TIM1_CH1__)) 41(PE10__(_FSMC_D7/TIM1_CH2N__)) 45(PE14__(_FSMC_D11/TIM1_CH4__)) 46(PE15__(_FSMC_D12/TIM1_BKIN__)) 97(PE0__(_TIM4_ETR_/_FSMC_NBL0_/_DCMI_D2__)) 98(PE1__(_FSMC_NBL1_/_DCMI_D3__))

### Library data of the parts
D1 D2 D22 = LED
R8-R10 = Res: Resistor; Published: 8-Jun-2000; LatestRevisionDate: 04-Mar-2005; LatestRevisionNote: PCB Footprint replaced.; PackageReference: J1-0603; Publisher: Altium Limited; Value: 330R
U3 = STM32F40x-VG

## Sheet STM32F407VG-F.SchDoc
size A4
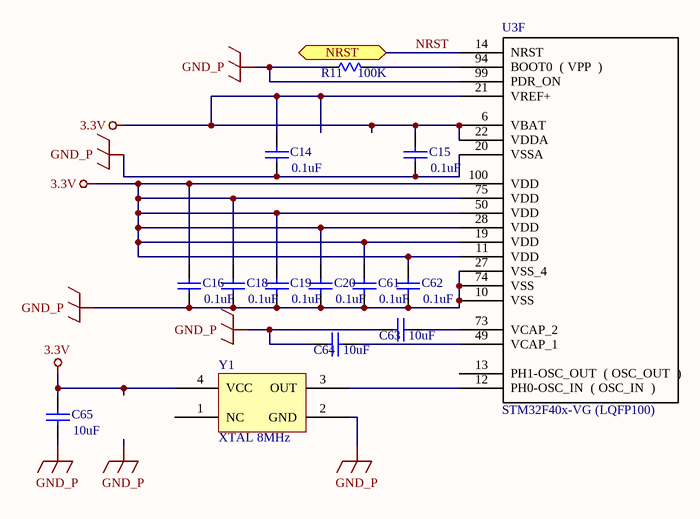
[diagram p9: STM32F407VG-F.SchDoc]

### Parts
C14  0.1uF  [C0603-S]
C15  0.1uF  [C0603-S]
C16  0.1uF  [C0603-S]
C18  0.1uF  [C0603-S]
C19  0.1uF  [C0603-S]
C20  0.1uF  [C0603-S]
C61  0.1uF  [C0603-S]
C62  0.1uF  [C0603-S]
C63  10uF  [C0603-S]
C64  10uF  [C0603-S]
C65  10uF  [C0603-S]
R11  100K  [R0603-S]
U3  STM32F40x-VG (LQFP100)  [LQFP100_N]  (part F of 6)
Y1  XTAL 8MHz  [XTAL 3.3X5.0S-SM]

### Ports
NRST (bidir)

### Nets
3.3V: C14.1 C15.1 C16.1 C18.1 C19.1 C20.1 C61.1 C62.1 C65.1 U3.6(VBAT) U3.11(VDD) U3.19(VDD) U3.21(VREF+) U3.22(VDDA) U3.28(VDD) U3.50(VDD) U3.75(VDD) U3.100(VDD) Y1.4(VCC)
GND_P: C14.2 C15.2 C16.2 C18.2 C19.2 C20.2 C61.2 C62.2 C63.1 C64.1 C65.2 R11.2 U3.10(VSS) U3.20(VSSA) U3.27(VSS_4) U3.74(VSS) U3.99(PDR_ON) Y1.2(GND)
NRST: U3.14(NRST) ; port NRST
NetC63_2: C63.2 U3.73(VCAP_2)
NetC64_2: C64.2 U3.49(VCAP_1)
NetR11_1: R11.1 U3.94(BOOT0__(_VPP__))
NetU3_12: U3.12(PH0-OSC_IN__(_OSC_IN__)) Y1.3(OUT)

Not connected (* = marked no-connect by the designer): U3 13(PH1-OSC_OUT__(_OSC_OUT__)); Y1 1(NC)

### Library data of the parts
C14-C16 C18-C20 C61-C65 = Cap: Capacitor; Published: 8-Jun-2000; Revision: July-2002: Re-released for DXP Platform.; Publisher: Altium Limited
  C14-C16 C18-C20 C61 C62: Value: 0.1uF
  C63-C65: Value: 10uF
R11 = Res: Resistor; Published: 8-Jun-2000; LatestRevisionDate: 04-Mar-2005; LatestRevisionNote: PCB Footprint replaced.; PackageReference: J1-0603; Publisher: Altium Limited; Value: 100K
U3 = STM32F40x-VG
Y1 = XTAL

## Sheet 海关全向本体电路板V3_电平转换.SchDoc
size A4
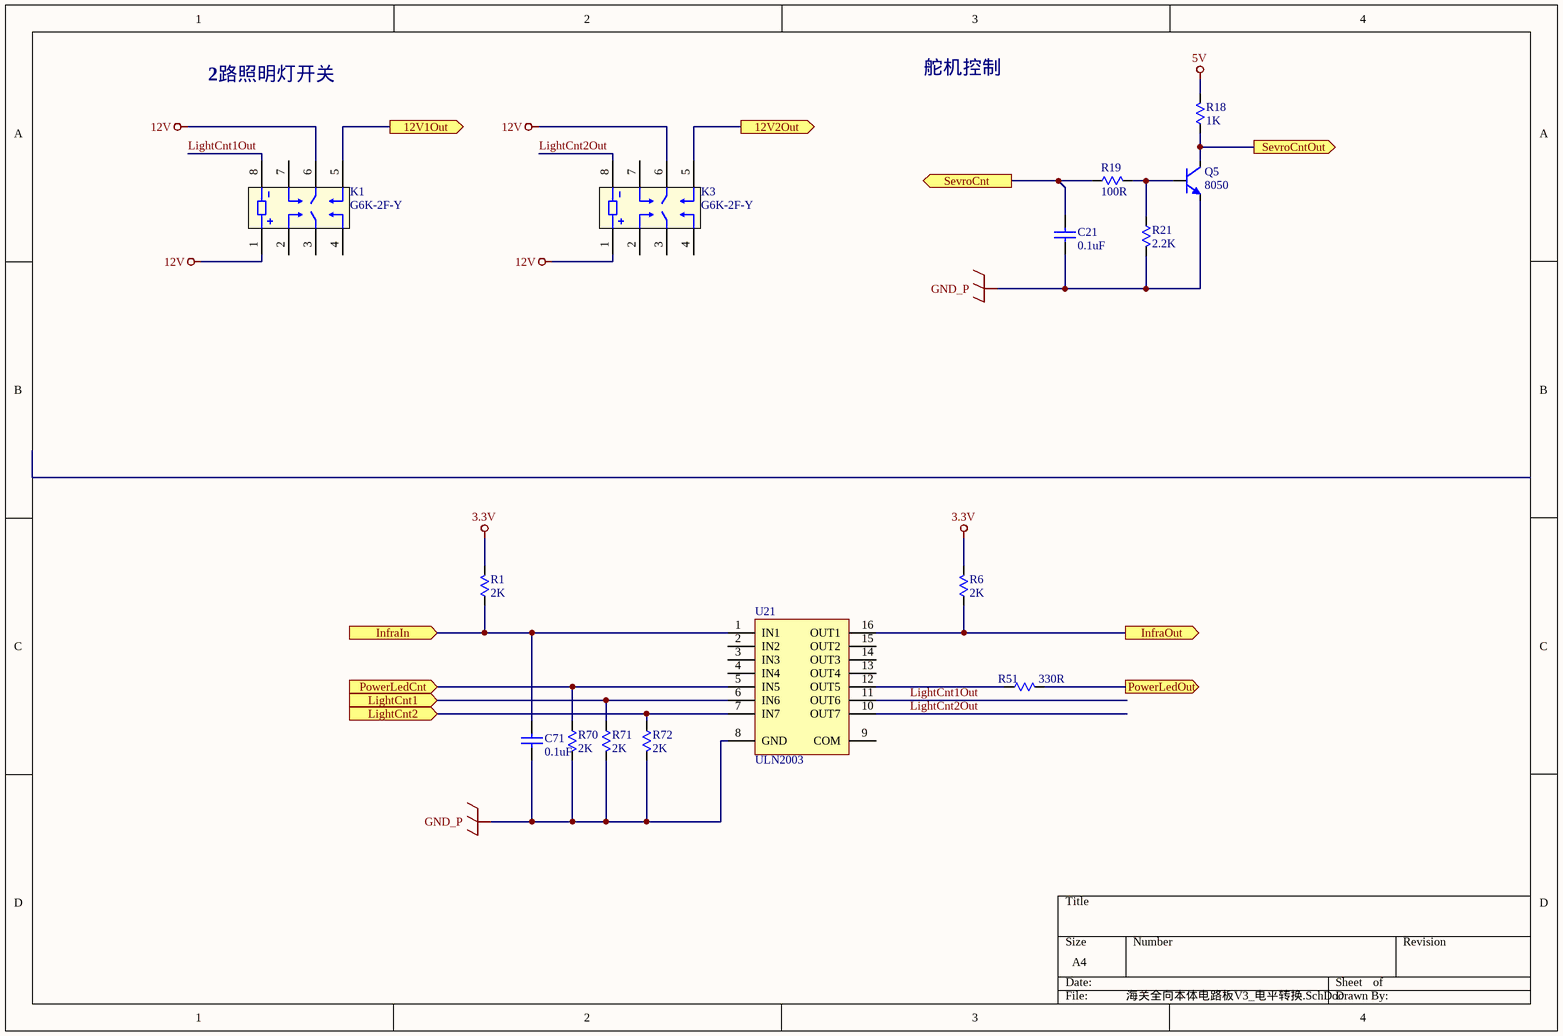
[diagram p10: 海关全向本体电路板V3_电平转换.SchDoc]

### Parts
C21  0.1uF  [C0603-S]
C71  0.1uF  [C0603-S]
K1  G6K-2F-Y  [G6K-2F-Y]
K3  G6K-2F-Y  [G6K-2F-Y]
Q5  8050  [SOT-23]
R1  2K  [R0603-S]
R6  2K  [R0603-S]
R18  1K  [R0603-S]
R19  100R  [R0603-S]
R21  2.2K  [R0603-S]
R51  330R  [R0603-S]
R70  2K  [R0603-S]
R71  2K  [R0603-S]
R72  2K  [R0603-S]
U21  ULN2003  [SO16-150]

### Ports
12V1Out (out), 12V2Out (out), InfraIn (in), InfraOut (out), LightCnt1 (in), LightCnt2 (in), PowerLedCnt (in), PowerLedOut (out), SevroCnt (out), SevroCntOut (out)

### Nets
3.3V: R1.1 R6.1
5V: R18.1
12V: K1.1 K1.6 K3.1 K3.6
GND_P: C21.1 C71.1 Q5.2(E) R21.1 R70.1 R71.1 R72.1 U21.8(GND)
12V1Out: K1.5 ; port 12V1Out
12V2Out: K3.5 ; port 12V2Out
InfraIn: C71.2 R1.2 U21.1(IN1) ; port InfraIn
LightCnt1Out: K1.8 U21.11(OUT6)
LightCnt2Out: K3.8 U21.10(OUT7)
PowerLedOut: R51.1 ; port PowerLedOut
SevroCntOut: Q5.3(C) R18.2 ; port SevroCntOut
NetC21_2: C21.2 R19.2 ; port SevroCnt
NetQ5_1: Q5.1(B) R19.1 R21.2
NetR6_2: R6.2 U21.16(OUT1) ; port InfraOut
NetR51_2: R51.2 U21.12(OUT5)
NetR70_2: R70.2 U21.5(IN5) ; port PowerLedCnt
NetR71_2: R71.2 U21.6(IN6) ; port LightCnt1
NetR72_2: R72.2 U21.7(IN7) ; port LightCnt2

Not connected (* = marked no-connect by the designer): K1 2 3 4 7; K3 2 3 4 7; U21 2(IN2) 3(IN3) 4(IN4) 9(COM) 13(OUT4) 14(OUT3) 15(OUT2)

### Notes on the sheet
- 2路照明灯开关
- 舵机控制

### Library data of the parts
C21 C71 = Cap: Capacitor; Value: 22pF; Published: 8-Jun-2000; Revision: July-2002: Re-released for DXP Platform.; Publisher: Altium Limited
Q5 = NPN: NPN General Purpose Amplifier; Published: 8-Jun-2000; LatestRevisionDate: 15-Jan-2003; LatestRevisionNote: PCB Footprint 'BCY-W3/D4.7' replaced; DatasheetDocument: 1997; PackageDocument: Sep-1998; PackageReference: TO-92A; Publisher: Altium Limited; Code_JEDEC: TO-92A; ComponentLink1Description: Manufacturer Link; ComponentLink1URL: http://www.fairchildsemi.com/; ComponentLink2Description: Datasheet; ComponentLink2URL: http://www.fairchildsemi.com/ds/2N%2F2N3904.pdf
R1 R6 R21 R51 R70-R72 = Res: Resistor; Published: 8-Jun-2000; LatestRevisionDate: 04-Mar-2005; LatestRevisionNote: PCB Footprint replaced.; PackageReference: J1-0603; Publisher: Altium Limited
  R1 R6 R70-R72: Value: 2K
  R21: Value: 2.2K
  R51: Value: 330R
R18 R19 = RES: Resistor; Published: 8-Jun-2000; LatestRevisionDate: 17-Jul-2002; LatestRevisionNote: Re-released for DXP Platform.; PackageReference: AXIAL-0.3; Publisher: Altium Limited
  R18: Value: 1K
  R19: Value: 100R

## Sheet 海关全向本体电路板V3_TTL通信.SchDoc
size A4
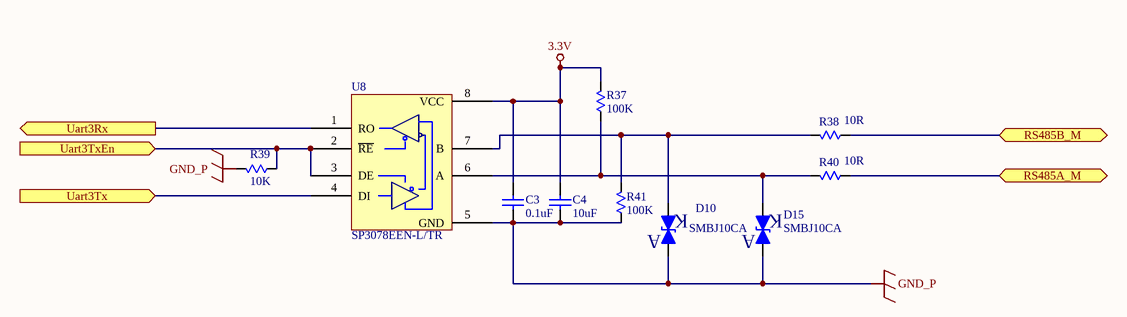
[diagram p11: 海关全向本体电路板V3_TTL通信.SchDoc]

### Parts
C3  0.1uF  [C0603-S]
C4  10uF  [C0603-S]
D10  SMBJ10CA  [SMB-S]
D15  SMBJ10CA  [SMB-S]
R37  100K  [R0603-S]
R38  10R  [R1206-S]
R39  10K  [R0603-S]
R40  10R  [R1206-S]
R41  100K  [R0603-S]
U8  SP3078EEN-L/TR  [SO8-150]

### Ports
RS485A_M (bidir), RS485B_M (bidir), Uart3Rx (out), Uart3Tx (in), Uart3TxEn (in)

### Nets
3.3V: C3.2 C4.2 R37.2 U8.8(VCC)
GND_P: C3.1 C4.1 D10.1(A) D15.1(A) R39.2 R41.1 U8.5(GND)
RS485A_M: R40.1 ; port RS485A_M
RS485B_M: R38.1 ; port RS485B_M
NetD10_2: D10.2(K) R38.2 R41.2 U8.7(B)
NetD15_2: D15.2(K) R37.1 R40.2 U8.6(A)
NetR39_1: R39.1 U8.2(~{RE}) U8.3(DE) ; port Uart3TxEn
NetU3_55: U8.4(DI) ; port Uart3Tx
NetU3_56: U8.1(RO) ; port Uart3Rx

### Library data of the parts
C3 C4 = CAP: Published: 8-Jun-2000; LatestRevisionDate: 17-Jul-2002; LatestRevisionNote: Re-released for DXP Platform.; PackageReference: RAD-0.3; Publisher: Altium Limited
  C3: Value: 0.1uF
  C4: Value: 10uF
D10 D15 = BS0300N
R37-R41 = RES: Resistor; Published: 8-Jun-2000; LatestRevisionDate: 17-Jul-2002; LatestRevisionNote: Re-released for DXP Platform.; PackageReference: AXIAL-0.3; Publisher: Altium Limited
  R37 R41: Value: 100K
  R38 R40: Value: 10R
  R39: Value: 10K
U8 = SP3078EEN

## Sheet 海关全向本体电路板V3_数图传通信.SchDoc
size A4
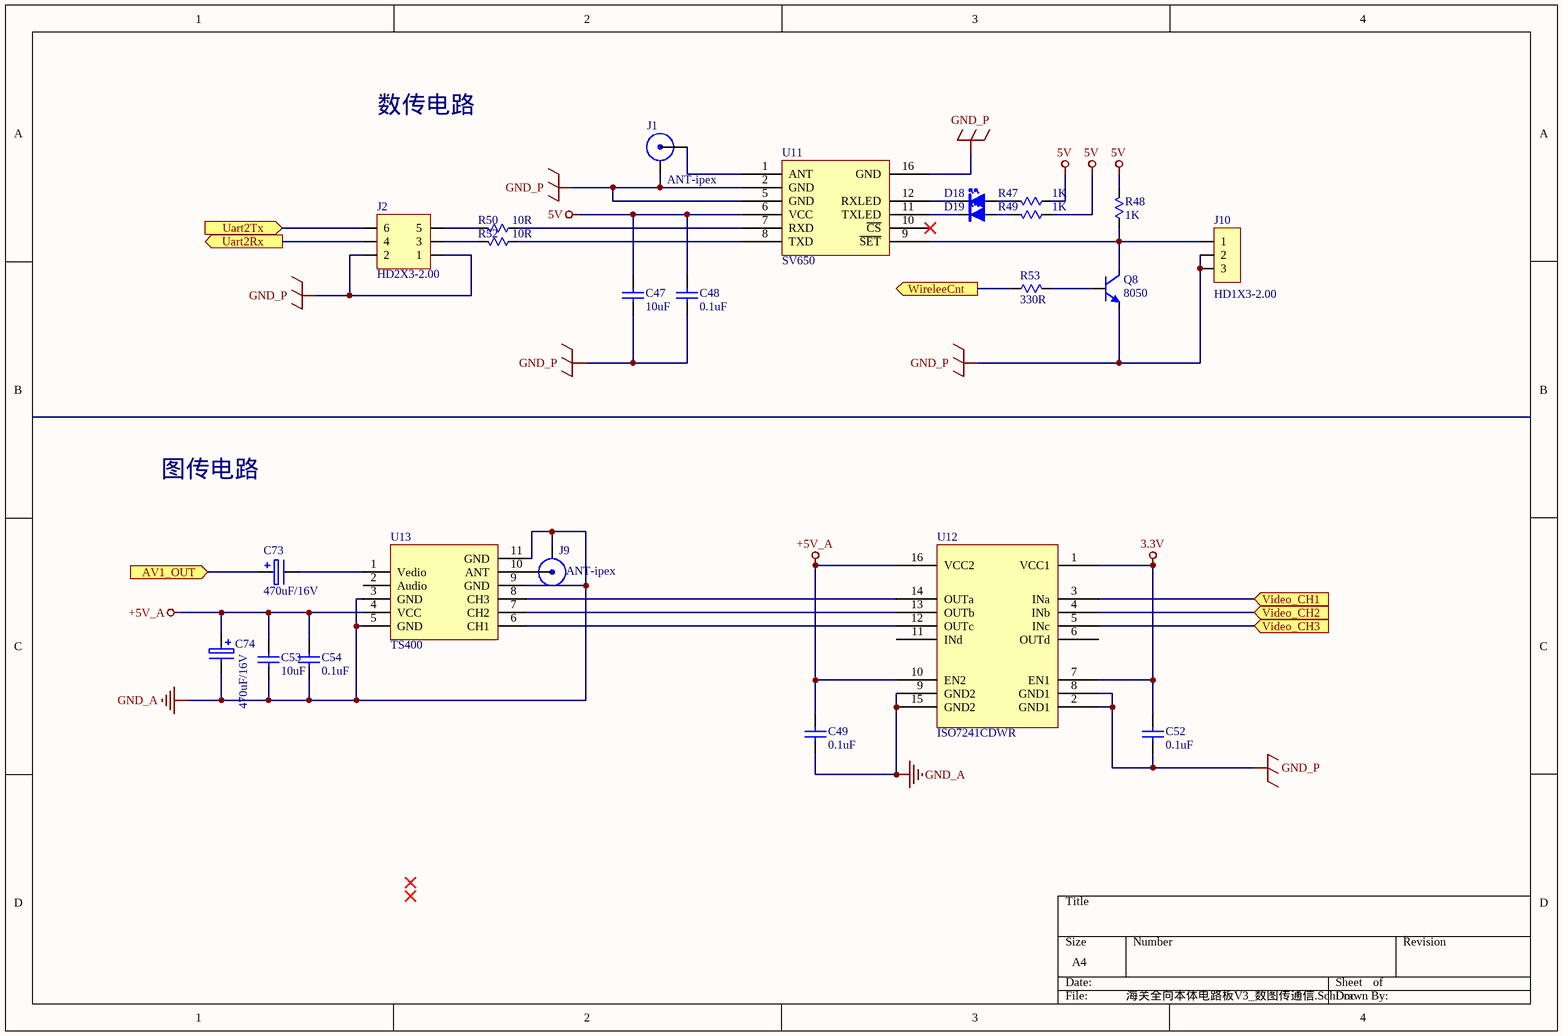
[diagram p12: 海关全向本体电路板V3_数图传通信.SchDoc]

### Parts
C47  10uF  [C0603-S]
C48  0.1uF  [C0603-S]
C49  0.1uF  [C0603-S]
C52  0.1uF  [C0603-S]
C53  10uF  [C0603-S]
C54  0.1uF  [C0603-S]
C73  470uF/16V  [CAPPR-8X10-SM]
C74  470uF/16V  [CAPPR-8X10-SM]
D18  LED  [LED0603]  (value not drawn)
D19  LED  [LED0603]  (value not drawn)
J1  ANT-ipex  [SMJB-5.00]
J2  HD2X3-2.00  [HD2X3-2.00]
J9  ANT-ipex  [SMJB-5.00]
J10  HD1X3-2.00  [HD1X3-2.00]
Q8  8050  [SOT-23]
R47  1K  [R0603-S]
R48  1K  [R0603-S]
R49  1K  [R0603-S]
R50  10R  [R0603-S]
R52  10R  [R0603-S]
R53  330R  [R0603-S]
U11  SV650  [SV650]
U12  ISO7241CDWR  [SO16-290]
U13  TS400  [TS400]

### Ports
AV1_OUT (in), Uart2Rx (out), Uart2Tx (in), Video_CH1 (in), Video_CH2 (in), Video_CH3 (in), WireleeCnt (out)

### Nets
3.3V: C52.2 U12.1(VCC1) U12.7(EN1)
5V: C47.2 C48.2 R47.1 R48.1 R49.1 U11.6(VCC)
+5V_A: C49.2 C53.2 C54.2 C74.1 U12.10(EN2) U12.16(VCC2) U13.4(VCC)
GND_A: C49.1 C53.1 C54.1 C74.2 J9.2(GND) U12.9(GND2) U12.15(GND2) U13.3(GND) U13.5(GND) U13.9(GND) U13.11(GND)
GND_P: C47.1 C48.1 C52.1 J1.2(GND) J2.1 J2.2 J10.2 J10.3 Q8.2(E) U11.2(GND) U11.5(GND) U11.16(GND) U12.2(GND1) U12.8(GND1)
AV1_OUT: C73.1 ; port AV1_OUT
NetC73_2: C73.2 U13.1(Vedio)
NetD18_1: D18.1(A) R47.2
NetD18_2: D18.2(K) U11.12(RXLED)
NetD19_1: D19.1(A) R49.2
NetD19_2: D19.2(K) U11.11(TXLED)
NetJ1_1: J1.1(ANT) U11.1(ANT)
NetJ2_3: J2.3 R52.2
NetJ2_4: J2.4 ; port Uart2Rx
NetJ2_5: J2.5 R50.2
NetJ2_6: J2.6 ; port Uart2Tx
NetJ9_1: J9.1(ANT) U13.10(ANT)
NetJ10_1: J10.1 Q8.3(C) R48.2 U11.9(~{SET})
NetQ8_1: Q8.1(B) R53.1
NetR50_1: R50.1 U11.7(RXD)
NetR52_1: R52.1 U11.8(TXD)
NetR53_2: R53.2 ; port WireleeCnt
NetU3_15: U12.3(INa) ; port Video_CH1
NetU3_16: U12.4(INb) ; port Video_CH2
NetU3_17: U12.5(INc) ; port Video_CH3
NetU12_12: U12.12(OUTc) U13.6(CH1)
NetU12_13: U12.13(OUTb) U13.7(CH2)
NetU12_14: U12.14(OUTa) U13.8(CH3)

Not connected (* = marked no-connect by the designer): U11 10(~{CS})*; U12 6(OUTd) 11(INd); U13 2(Audio)

### Notes on the sheet
- 数传电路
- 图传电路

### Library data of the parts
C47-C49 C52-C54 = Cap Semi
C73 C74 = ELECTRO: Electrolytic Capacitor
J2 = HEADER2X3-2.0
J10 = HEADER1X3
Q8 = NPN: NPN General Purpose Amplifier; Published: 8-Jun-2000; LatestRevisionDate: 15-Jan-2003; LatestRevisionNote: PCB Footprint 'BCY-W3/D4.7' replaced; DatasheetDocument: 1997; PackageDocument: Sep-1998; PackageReference: TO-92A; Publisher: Altium Limited; Code_JEDEC: TO-92A; ComponentLink1Description: Manufacturer Link; ComponentLink1URL: http://www.fairchildsemi.com/; ComponentLink2Description: Datasheet; ComponentLink2URL: http://www.fairchildsemi.com/ds/2N%2F2N3904.pdf
R47 R49 R50 R52 = Res: Resistor; Published: 8-Jun-2000; LatestRevisionDate: 04-Mar-2005; LatestRevisionNote: PCB Footprint replaced.; PackageReference: J1-0603; Publisher: Altium Limited
R48 R53 = RES: Resistor; Published: 8-Jun-2000; LatestRevisionDate: 17-Jul-2002; LatestRevisionNote: Re-released for DXP Platform.; PackageReference: AXIAL-0.3; Publisher: Altium Limited
  R48: Value: 1K
  R53: Value: 330R
U12 = ISO7241A: Octal bus transceiver and 3.3V to 5V shifter with 3-state outputs

## Sheet 海关全向本体电路板V3_扩展RS485通信.SchDoc
size A4
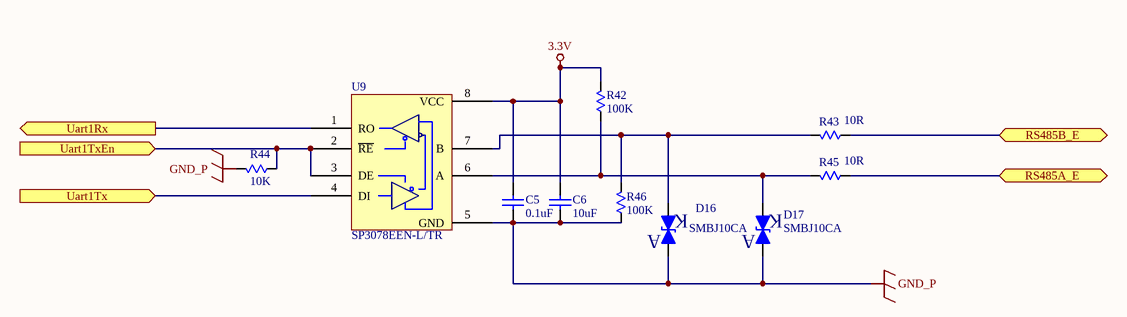
[diagram p13: 海关全向本体电路板V3_扩展RS485通信.SchDoc]

### Parts
C5  0.1uF  [C0603-S]
C6  10uF  [C0603-S]
D16  SMBJ10CA  [SMB-S]
D17  SMBJ10CA  [SMB-S]
R42  100K  [R0603-S]
R43  10R  [R1206-S]
R44  10K  [R0603-S]
R45  10R  [R1206-S]
R46  100K  [R0603-S]
U9  SP3078EEN-L/TR  [SO8-150]

### Ports
RS485A_E (bidir), RS485B_E (bidir), Uart1Rx (out), Uart1Tx (in), Uart1TxEn (in)

### Nets
3.3V: C5.2 C6.2 R42.2 U9.8(VCC)
GND_P: C5.1 C6.1 D16.1(A) D17.1(A) R44.2 R46.1 U9.5(GND)
RS485A_E: R45.1 ; port RS485A_E
RS485B_E: R43.1 ; port RS485B_E
NetD16_2: D16.2(K) R43.2 R46.2 U9.7(B)
NetD17_2: D17.2(K) R42.1 R45.2 U9.6(A)
NetR44_1: R44.1 U9.2(~{RE}) U9.3(DE) ; port Uart1TxEn
NetU3_68: U9.4(DI) ; port Uart1Tx
NetU3_69: U9.1(RO) ; port Uart1Rx

### Library data of the parts
C5 C6 = CAP: Published: 8-Jun-2000; LatestRevisionDate: 17-Jul-2002; LatestRevisionNote: Re-released for DXP Platform.; PackageReference: RAD-0.3; Publisher: Altium Limited
  C5: Value: 0.1uF
  C6: Value: 10uF
D16 D17 = BS0300N
R42-R46 = RES: Resistor; Published: 8-Jun-2000; LatestRevisionDate: 17-Jul-2002; LatestRevisionNote: Re-released for DXP Platform.; PackageReference: AXIAL-0.3; Publisher: Altium Limited
  R42 R46: Value: 100K
  R43 R45: Value: 10R
  R44: Value: 10K
U9 = SP3078EEN

## Sheet 海关全向本体电路板V3_2路电池接入.SchDoc
size A4
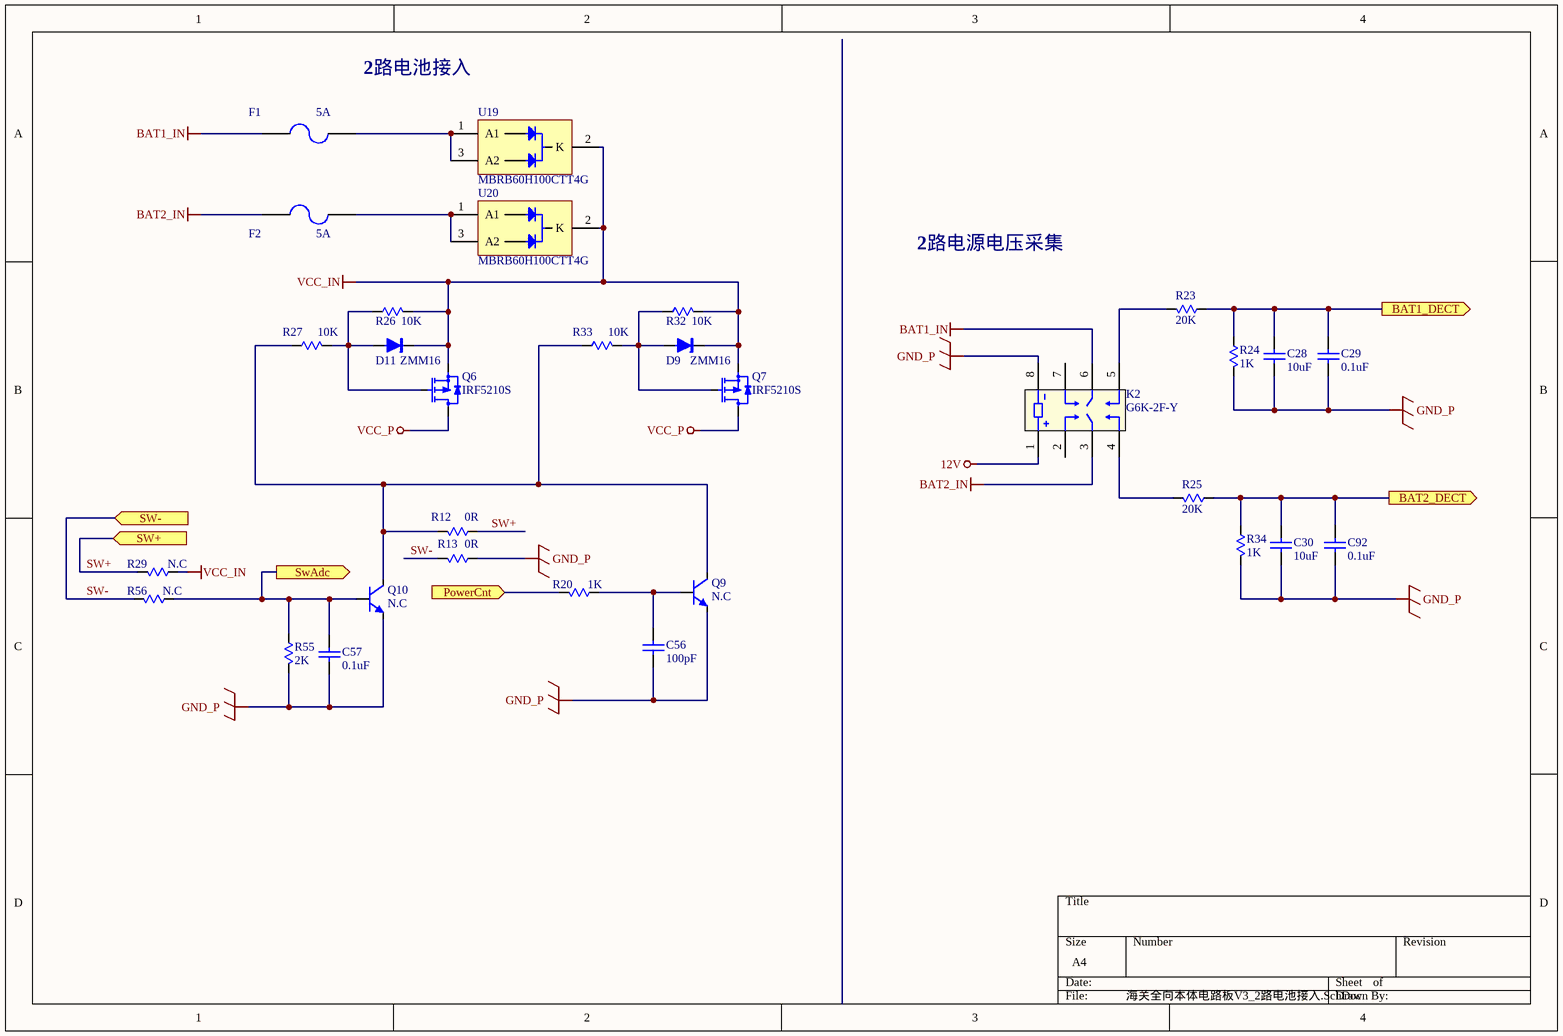
[diagram p14: 海关全向本体电路板V3_2路电池接入.SchDoc]

### Parts
C28  10uF  [C0603-S]
C29  0.1uF  [C0603-S]
C30  10uF  [C0603-S]
C56  100pF  [C0603-S]
C57  0.1uF  [C0603-S]
C92  0.1uF  [C0603-S]
D9  ZMM16  [SOD-80-S]
D11  ZMM16  [SOD-80-S]
F1  5A  [AXIAL0.5]
F2  5A  [AXIAL0.5]
K2  G6K-2F-Y  [G6K-2F-Y]
Q6  IRF5210S  [TO-263]
Q7  IRF5210S  [TO-263]
Q9  N.C  [SOT-23]
Q10  N.C  [SOT-23]
R12  0R  [R1206-S]
R13  0R  [R1206-S]
R20  1K  [R0805-S]
R23  20K  [R0805-S]
R24  1K  [R0805-S]
R25  20K  [R0805-S]
R26  10K  [R0805-S]
R27  10K  [R0805-S]
R29  N.C  [R0805-S]
R32  10K  [R0805-S]
R33  10K  [R0805-S]
R34  1K  [R0805-S]
R55  2K  [R0805-S]
R56  N.C  [R0805-S]
U19  MBRB60H100CTT4G  [TO-263-S]
U20  MBRB60H100CTT4G  [TO-263-S]

### Ports
BAT1_DECT (out), BAT2_DECT (out), PowerCnt (in), SW+ (in), SW- (in), SwAdc (out)

### Nets
12V: K2.1
BAT1_IN: F1.1 K2.6
BAT2_IN: F2.1 K2.3
GND_P: C28.2 C29.2 C30.2 C56.1 C57.1 C92.2 K2.8 Q9.2(E) Q10.2(E) R13.1 R24.1 R34.1 R55.1
VCC_IN: D9.2(K) D11.2(K) Q6.3(S) Q7.3(S) R26.1 R29.2 R32.1 U19.2(K) U20.2(K)
VCC_P: Q6.2(D) Q7.2(D)
SW+: R12.1 R29.1 ; port SW+
SW-: R13.2 R56.1 ; port SW-
NetC28_1: C28.1 C29.1 R23.2 R24.2 ; port BAT1_DECT
NetC30_1: C30.1 C92.1 R25.2 R34.2 ; port BAT2_DECT
NetC56_2: C56.2 Q9.1(B) R20.2
NetC57_2: C57.2 Q10.1(B) R55.2 R56.2 ; port SwAdc
NetD9_1: D9.1(A) Q7.1(G) R32.2 R33.1
NetD11_1: D11.1(A) Q6.1(G) R26.2 R27.1
NetF1_2: F1.2 U19.1(A1) U19.3(A2)
NetF2_2: F2.2 U20.1(A1) U20.3(A2)
NetK2_4: K2.4 R25.1
NetK2_5: K2.5 R23.1
NetQ9_3: Q9.3(C) Q10.3(C) R12.2 R27.2 R33.2
NetR20_1: R20.1 ; port PowerCnt

Not connected (* = marked no-connect by the designer): K2 2 7

### Notes on the sheet
- 2路电池接入
- 2路电源电压采集

### Library data of the parts
C28-C30 C92 = CAP: Published: 8-Jun-2000; LatestRevisionDate: 17-Jul-2002; LatestRevisionNote: Re-released for DXP Platform.; PackageReference: RAD-0.3; Publisher: Altium Limited
  C28 C30: Value: 10uF
  C29 C92: Value: 0.1uF
C56 C57 = Cap: Capacitor; Value: 22pF; Published: 8-Jun-2000; Revision: July-2002: Re-released for DXP Platform.; Publisher: Altium Limited
D9 D11 = DIODE-ZENER: Small Signal Zener Diodes
F1 F2 = FUSE2: Fuse
Q6 Q7 = PMOS: P-Channel 30-V (D-S), 150 C MOSFET
Q9 Q10 = NPN: NPN General Purpose Amplifier; Published: 8-Jun-2000; LatestRevisionDate: 15-Jan-2003; LatestRevisionNote: PCB Footprint 'BCY-W3/D4.7' replaced; DatasheetDocument: 1997; PackageDocument: Sep-1998; PackageReference: TO-92A; Publisher: Altium Limited; Code_JEDEC: TO-92A; ComponentLink1Description: Manufacturer Link; ComponentLink1URL: http://www.fairchildsemi.com/; ComponentLink2Description: Datasheet; ComponentLink2URL: http://www.fairchildsemi.com/ds/2N%2F2N3904.pdf
R12 R13 R23-R25 R34 = RES: Resistor; Published: 8-Jun-2000; LatestRevisionDate: 17-Jul-2002; LatestRevisionNote: Re-released for DXP Platform.; PackageReference: AXIAL-0.3; Publisher: Altium Limited
  R12 R13: Value: 0R
  R23 R25: Value: 20K
  R24 R34: Value: 1K
R20 R26 R27 R29 R32 R33 R55 R56 = Res: Resistor; Published: 8-Jun-2000; LatestRevisionDate: 04-Mar-2005; LatestRevisionNote: PCB Footprint replaced.; PackageReference: J1-0603; Publisher: Altium Limited
  R20: Value: 1K
  R26 R27 R32 R33: Value: 10K
  R29 R56: Value: N.C
  R55: Value: 2K
U19 U20 = VB30200C

## Sheet 海关全向本体电路板V3_通信隔离.SchDoc
size A4
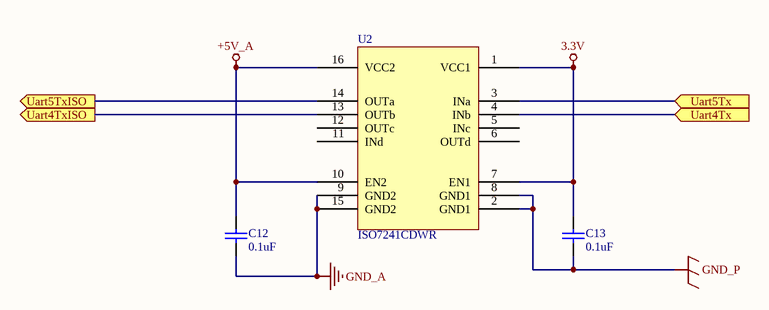
[diagram p15: 海关全向本体电路板V3_通信隔离.SchDoc]

### Parts
C12  0.1uF  [C0603-S]
C13  0.1uF  [C0603-S]
U2  ISO7241CDWR  [SO16-290]

### Ports
Uart4Tx (in), Uart4TxISO (out), Uart5Tx (in), Uart5TxISO (out)

### Nets
3.3V: C13.2 U2.1(VCC1) U2.7(EN1)
+5V_A: C12.2 U2.10(EN2) U2.16(VCC2)
GND_A: C12.1 U2.9(GND2) U2.15(GND2)
GND_P: C13.1 U2.2(GND1) U2.8(GND1)
Uart4TxISO: U2.13(OUTb) ; port Uart4TxISO
Uart5TxISO: U2.14(OUTa) ; port Uart5TxISO
NetU2_3: U2.3(INa) ; port Uart5Tx
NetU2_4: U2.4(INb) ; port Uart4Tx

Not connected (* = marked no-connect by the designer): U2 5(INc) 6(OUTd) 11(INd) 12(OUTc)

### Library data of the parts
C12 C13 = Cap Semi
U2 = ISO7241A: as U12 on sheet 海关全向本体电路板V3_数图传通信

## Sheet 海关全向本体电路板V3_Mpu6050模块.SchDoc
size A4
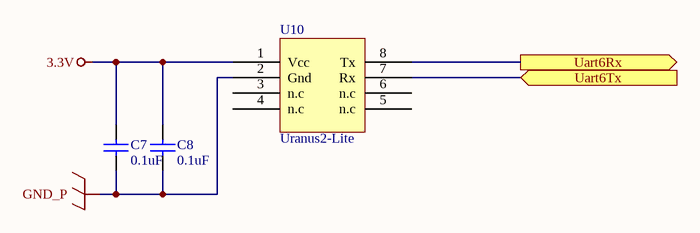
[diagram p16: 海关全向本体电路板V3_Mpu6050模块.SchDoc]

### Parts
C7  0.1uF  [C0603-S]
C8  0.1uF  [C0603-S]
U10  Uranus2-Lite  [Uranus2-Lite]

### Ports
Uart6Rx (out), Uart6Tx (in)

### Nets
3.3V: C7.2 C8.2 U10.1(Vcc)
GND_P: C7.1 C8.1 U10.2(Gnd)
NetU3_63: U10.7(Rx) ; port Uart6Tx
NetU3_64: U10.8(Tx) ; port Uart6Rx

Not connected (* = marked no-connect by the designer): U10 3(n.c) 4(n.c) 5(n.c) 6(n.c)

### Library data of the parts
C7 C8 = CAP: Published: 8-Jun-2000; LatestRevisionDate: 17-Jul-2002; LatestRevisionNote: Re-released for DXP Platform.; PackageReference: RAD-0.3; Publisher: Altium Limited; Value: 0.1uF

## Nets that join several sheets
3.3V: 海关全向本体电路板V3_电源管理 (C10.1 C11.2 L1.1 TP1.1), 海关全向本体电路板V3_主控芯片 (J7.1 R7.2), STM32F407VG-E (R8.2 R9.2 R10.2), STM32F407VG-F (19 pins), 海关全向本体电路板V3_电平转换 (R1.1 R6.1), 海关全向本体电路板V3_TTL通信 (C3.2 C4.2 R37.2 U8.8), 海关全向本体电路板V3_数图传通信 (C52.2 U12.1 U12.7), 海关全向本体电路板V3_扩展RS485通信 (C5.2 C6.2 R42.2 U9.8), 海关全向本体电路板V3_通信隔离 (C13.2 U2.1 U2.7), 海关全向本体电路板V3_Mpu6050模块 (C7.2 C8.2 U10.1)
5V: 海关全向本体电路板V3_系统管理 (J27.1 J29.1), 海关全向本体电路板V3_电源管理 (8 pins), 海关全向本体电路板V3_电平转换 (R18.1), 海关全向本体电路板V3_数图传通信 (6 pins)
12V: 海关全向本体电路板V3_系统管理 (J8.1 J16.1 J29.3), 海关全向本体电路板V3_电机驱动管理 (16 pins), 海关全向本体电路板V3_电源管理 (C1.1 C41.2 L3.1 R28.1), 海关全向本体电路板V3_电平转换 (K1.1 K1.6 K3.1 K3.6), 海关全向本体电路板V3_2路电池接入 (K2.1)
+5V_A: 海关全向本体电路板V3_电源管理 (8 pins), 海关全向本体电路板V3_数图传通信 (7 pins), 海关全向本体电路板V3_通信隔离 (C12.2 U2.10 U2.16)
+12V_A: 海关全向本体电路板V3_系统管理 (D4.1 J6.5 J17.1 J22.1), 海关全向本体电路板V3_电源管理 (9 pins)
BAT1_IN: 海关全向本体电路板V3_系统管理 (J3.1), 海关全向本体电路板V3_2路电池接入 (F1.1 K2.6)
BAT2_IN: 海关全向本体电路板V3_系统管理 (J5.1), 海关全向本体电路板V3_2路电池接入 (F2.1 K2.3)
GND_A: 海关全向本体电路板V3_系统管理 (7 pins), 海关全向本体电路板V3_电源管理 (19 pins), 海关全向本体电路板V3_数图传通信 (11 pins), 海关全向本体电路板V3_通信隔离 (C12.1 U2.9 U2.15)
GND_P: 海关全向本体电路板V3_系统管理 (10 pins), 海关全向本体电路板V3_电机驱动管理 (64 pins), 海关全向本体电路板V3_电源管理 (31 pins), 海关全向本体电路板V3_主控芯片 (C9.2 J7.3), STM32F407VG-F (18 pins), 海关全向本体电路板V3_电平转换 (8 pins), 海关全向本体电路板V3_TTL通信 (7 pins), 海关全向本体电路板V3_数图传通信 (14 pins), 海关全向本体电路板V3_扩展RS485通信 (7 pins), 海关全向本体电路板V3_2路电池接入 (13 pins), 海关全向本体电路板V3_通信隔离 (C13.1 U2.2 U2.8), 海关全向本体电路板V3_Mpu6050模块 (C7.1 C8.1 U10.2)
VCC_P: 海关全向本体电路板V3_系统管理 (J28.1), 海关全向本体电路板V3_电机驱动管理 (48 pins), 海关全向本体电路板V3_电源管理 (13 pins), 海关全向本体电路板V3_2路电池接入 (Q6.2 Q7.2)
12V1Out: 海关全向本体电路板V3_系统管理 (J21.6), 海关全向本体电路板V3_电平转换 (K1.5)
12V2Out: 海关全向本体电路板V3_系统管理 (J6.2), 海关全向本体电路板V3_电平转换 (K3.5)
AV1_OUT: 海关全向本体电路板V3_系统管理 (J22.7), 海关全向本体电路板V3_数图传通信 (C73.1)
InfraIn: 海关全向本体电路板V3_系统管理 (J8.3), 海关全向本体电路板V3_电平转换 (C71.2 R1.2 U21.1)
NetC21_2: STM32F407VG-E (U3.4), 海关全向本体电路板V3_电平转换 (C21.2 R19.2)
NetC28_1: STM32F407VG-A (U3.26), 海关全向本体电路板V3_2路电池接入 (C28.1 C29.1 R23.2 R24.2)
NetC30_1: STM32F407VG-A (U3.29), 海关全向本体电路板V3_2路电池接入 (C30.1 C92.1 R25.2 R34.2)
NetC57_2: STM32F407VG-A (U3.24), 海关全向本体电路板V3_2路电池接入 (C57.2 Q10.1 R55.2 R56.2)
NetJ2_4: STM32F407VG-D (U3.87), 海关全向本体电路板V3_数图传通信 (J2.4)
NetJ2_6: STM32F407VG-D (U3.86), 海关全向本体电路板V3_数图传通信 (J2.6)
NetR6_2: STM32F407VG-C (U3.33), 海关全向本体电路板V3_电平转换 (R6.2 U21.16)
NetR20_1: STM32F407VG-D (U3.62), 海关全向本体电路板V3_2路电池接入 (R20.1)
NetR39_1: STM32F407VG-A (U3.32), 海关全向本体电路板V3_TTL通信 (R39.1 U8.2 U8.3)
NetR44_1: STM32F407VG-A (U3.67), 海关全向本体电路板V3_扩展RS485通信 (R44.1 U9.2 U9.3)
NetR53_2: STM32F407VG-D (U3.57), 海关全向本体电路板V3_数图传通信 (R53.2)
NetR70_2: STM32F407VG-D (U3.58), 海关全向本体电路板V3_电平转换 (R70.2 U21.5)
NetR71_2: STM32F407VG-D (U3.60), 海关全向本体电路板V3_电平转换 (R71.2 U21.6)
NetR72_2: STM32F407VG-D (U3.61), 海关全向本体电路板V3_电平转换 (R72.2 U21.7)
NetU2_3: STM32F407VG-C (U3.80), 海关全向本体电路板V3_通信隔离 (U2.3)
NetU2_4: STM32F407VG-C (U3.78), 海关全向本体电路板V3_通信隔离 (U2.4)
NetU3_15: STM32F407VG-C (U3.15), 海关全向本体电路板V3_数图传通信 (U12.3)
NetU3_16: STM32F407VG-C (U3.16), 海关全向本体电路板V3_数图传通信 (U12.4)
NetU3_17: STM32F407VG-C (U3.17), 海关全向本体电路板V3_数图传通信 (U12.5)
NetU3_55: STM32F407VG-D (U3.55), 海关全向本体电路板V3_TTL通信 (U8.4)
NetU3_56: STM32F407VG-D (U3.56), 海关全向本体电路板V3_TTL通信 (U8.1)
NetU3_63: STM32F407VG-C (U3.63), 海关全向本体电路板V3_Mpu6050模块 (U10.7)
NetU3_64: STM32F407VG-C (U3.64), 海关全向本体电路板V3_Mpu6050模块 (U10.8)
NetU3_68: STM32F407VG-A (U3.68), 海关全向本体电路板V3_扩展RS485通信 (U9.4)
NetU3_69: STM32F407VG-A (U3.69), 海关全向本体电路板V3_扩展RS485通信 (U9.1)
NRST: 海关全向本体电路板V3_主控芯片 (C9.1 R7.1), STM32F407VG-F (U3.14)
PowerLedOut: 海关全向本体电路板V3_系统管理 (J16.2), 海关全向本体电路板V3_电平转换 (R51.1)
RS485A_E: 海关全向本体电路板V3_系统管理 (J28.3), 海关全向本体电路板V3_扩展RS485通信 (R45.1)
RS485A_M: 海关全向本体电路板V3_电机驱动管理 (8 pins), 海关全向本体电路板V3_TTL通信 (R40.1)
RS485B_E: 海关全向本体电路板V3_系统管理 (J28.4), 海关全向本体电路板V3_扩展RS485通信 (R43.1)
RS485B_M: 海关全向本体电路板V3_电机驱动管理 (8 pins), 海关全向本体电路板V3_TTL通信 (R38.1)
SevroCntOut: 海关全向本体电路板V3_系统管理 (J27.3), 海关全向本体电路板V3_电平转换 (Q5.3 R18.2)
SW+: 海关全向本体电路板V3_系统管理 (J16.4), 海关全向本体电路板V3_2路电池接入 (R12.1 R29.1)
SW-: 海关全向本体电路板V3_系统管理 (J16.3), 海关全向本体电路板V3_2路电池接入 (R13.2 R56.1)
SWCLK: 海关全向本体电路板V3_主控芯片 (J7.2), STM32F407VG-A (U3.76)
SWDIO: 海关全向本体电路板V3_主控芯片 (J7.4), STM32F407VG-A (U3.72)
Uart4TxISO: 海关全向本体电路板V3_系统管理 (J21.5), 海关全向本体电路板V3_通信隔离 (U2.13)
Uart5TxISO: 海关全向本体电路板V3_系统管理 (J22.5), 海关全向本体电路板V3_通信隔离 (U2.14)